# Altium project firesys.PrjPcb (part 2 of 2)

## Sheet ShiftRegister.SchDoc
size A3; SheetNumber: 6; SheetTotal: 11
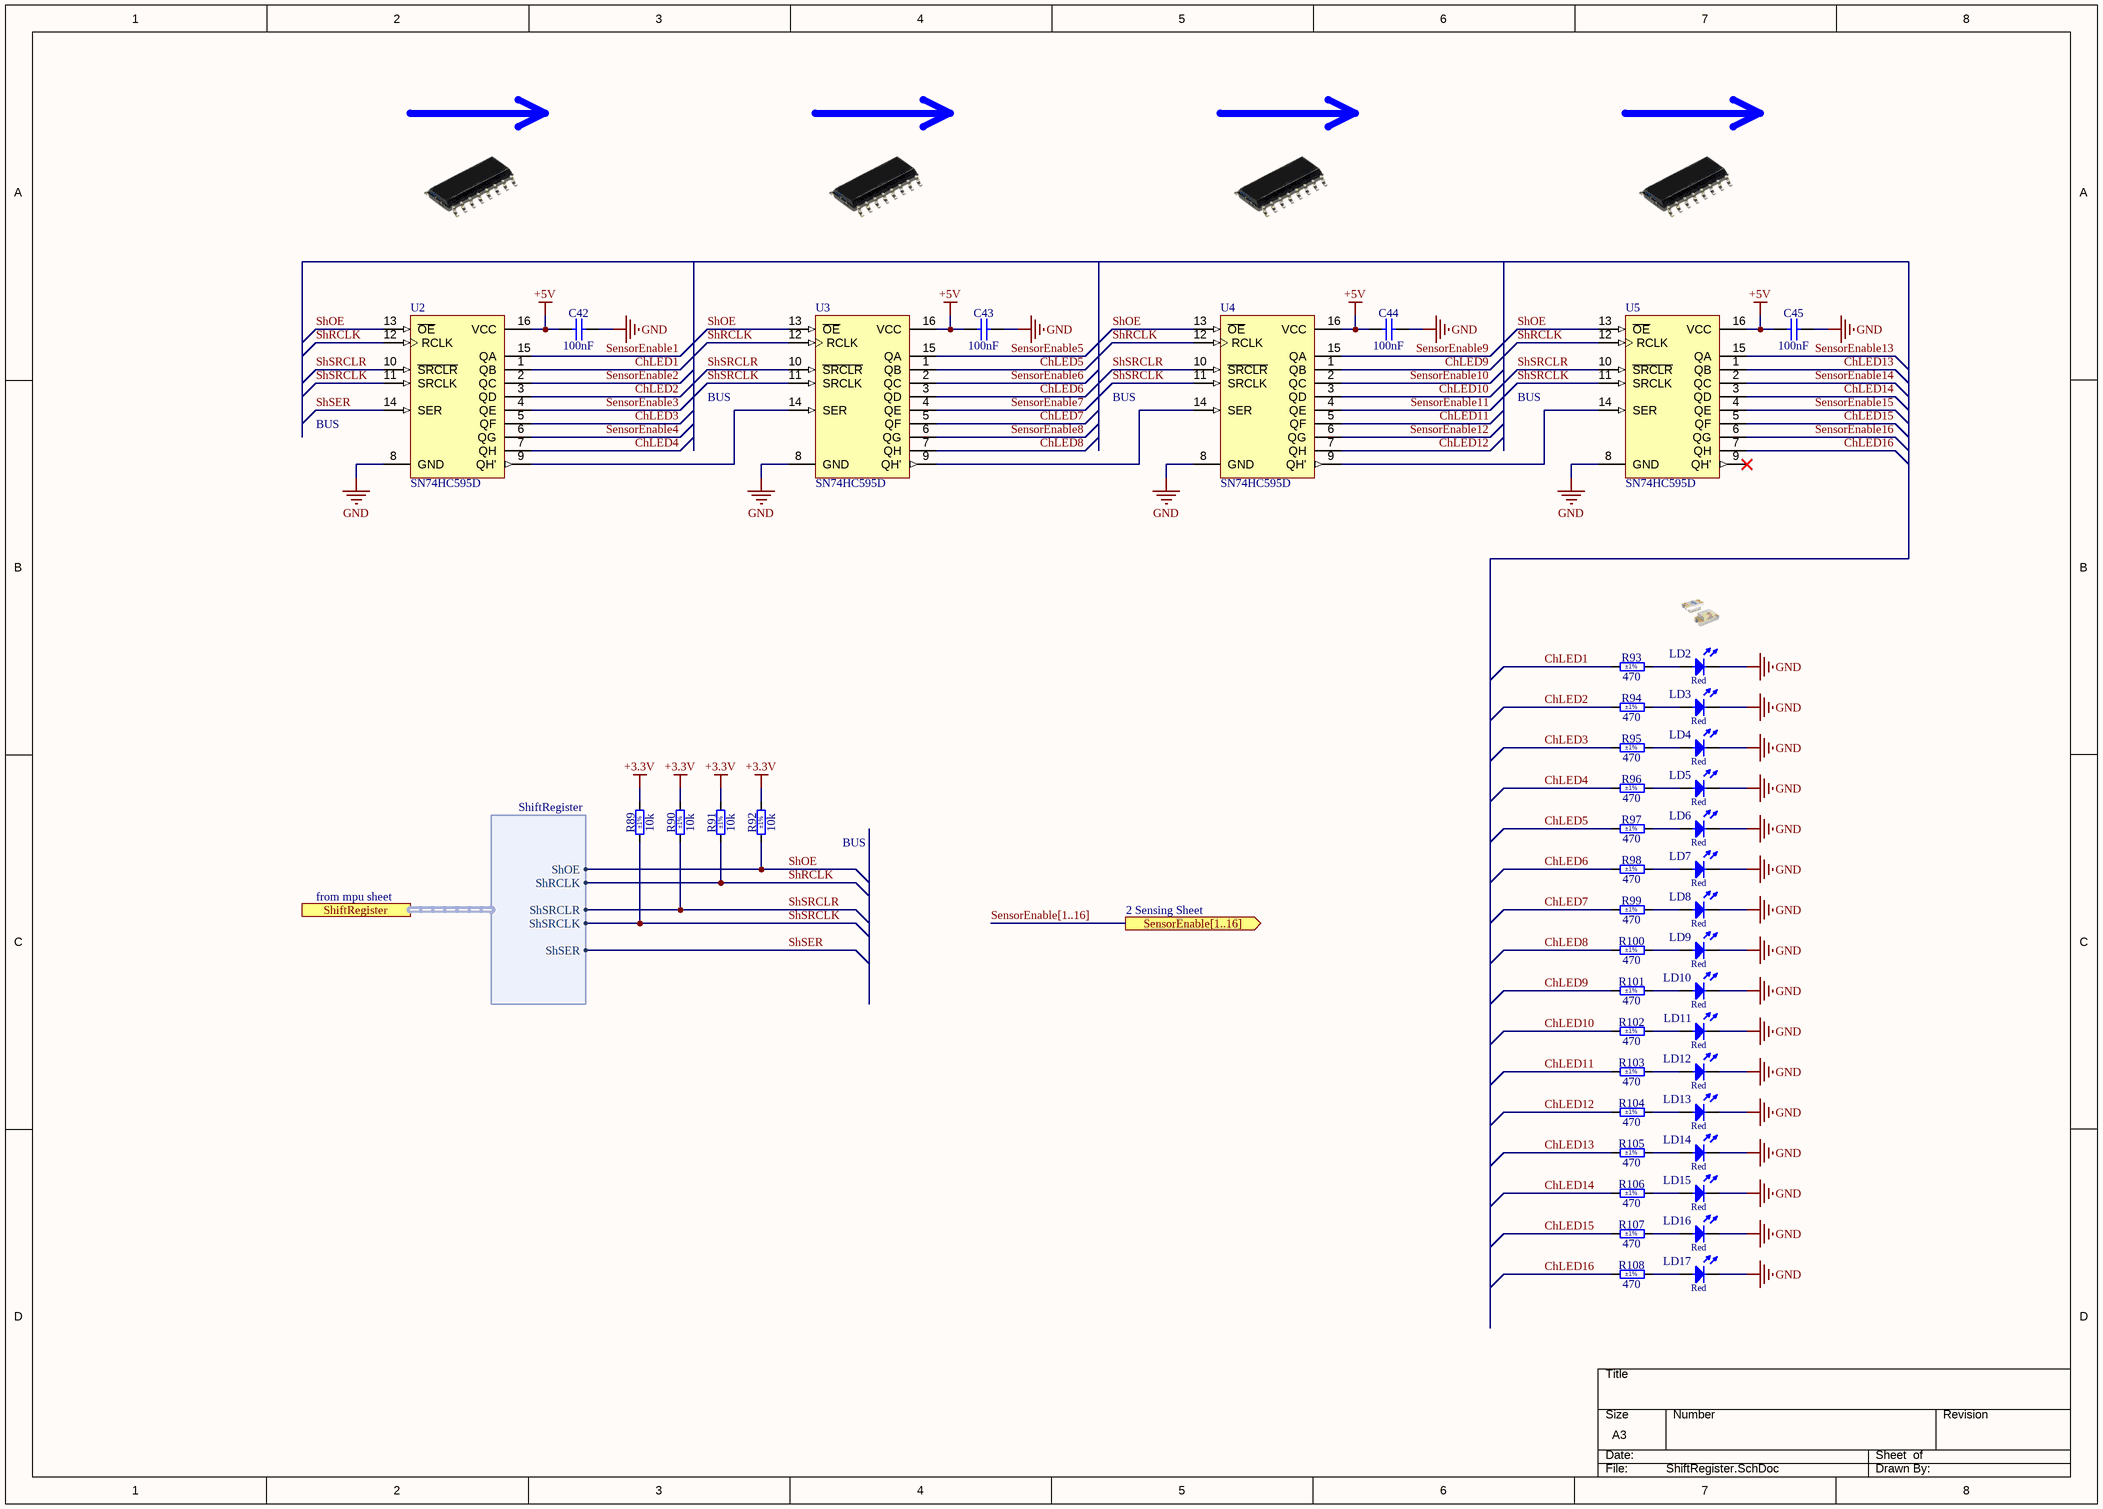
[diagram p4: ShiftRegister.SchDoc]

### Parts
C42  100nF  [CAPC1608X87N]
C43  100nF  [CAPC1608X87N]
C44  100nF  [CAPC1608X87N]
C45  100nF  [CAPC1608X87N]
LD2  Red  [LED_AVAGO_HSMH-C150]
LD3  Red  [LED_AVAGO_HSMH-C150]
LD4  Red  [LED_AVAGO_HSMH-C150]
LD5  Red  [LED_AVAGO_HSMH-C150]
LD6  Red  [LED_AVAGO_HSMH-C150]
LD7  Red  [LED_AVAGO_HSMH-C150]
LD8  Red  [LED_AVAGO_HSMH-C150]
LD9  Red  [LED_AVAGO_HSMH-C150]
LD10  Red  [LED_AVAGO_HSMH-C150]
LD11  Red  [LED_AVAGO_HSMH-C150]
LD12  Red  [LED_AVAGO_HSMH-C150]
LD13  Red  [LED_AVAGO_HSMH-C150]
LD14  Red  [LED_AVAGO_HSMH-C150]
LD15  Red  [LED_AVAGO_HSMH-C150]
LD16  Red  [LED_AVAGO_HSMH-C150]
LD17  Red  [LED_AVAGO_HSMH-C150]
R89  10k  Tolerance: ±1%  [RESC1608X55N]
R90  10k  Tolerance: ±1%  [RESC1608X55N]
R91  10k  Tolerance: ±1%  [RESC1608X55N]
R92  10k  Tolerance: ±1%  [RESC1608X55N]
R93  470  Tolerance: ±1%  [RESC1608X55N]
R94  470  Tolerance: ±1%  [RESC1608X55N]
R95  470  Tolerance: ±1%  [RESC1608X55N]
R96  470  Tolerance: ±1%  [RESC1608X55N]
R97  470  Tolerance: ±1%  [RESC1608X55N]
R98  470  Tolerance: ±1%  [RESC1608X55N]
R99  470  Tolerance: ±1%  [RESC1608X55N]
R100  470  Tolerance: ±1%  [RESC1608X55N]
R101  470  Tolerance: ±1%  [RESC1608X55N]
R102  470  Tolerance: ±1%  [RESC1608X55N]
R103  470  Tolerance: ±1%  [RESC1608X55N]
R104  470  Tolerance: ±1%  [RESC1608X55N]
R105  470  Tolerance: ±1%  [RESC1608X55N]
R106  470  Tolerance: ±1%  [RESC1608X55N]
R107  470  Tolerance: ±1%  [RESC1608X55N]
R108  470  Tolerance: ±1%  [RESC1608X55N]
U2  SN74HC595D  [SO16]
U3  SN74HC595D  [SO16]
U4  SN74HC595D  [SO16]
U5  SN74HC595D  [SO16]

### Ports
SensorEnable[1..16] (out), ShiftRegister (harness ShiftRegister)

### Harnesses
ShiftRegister: ShOE, ShRCLK, ShSRCLR, ShSRCLK, ShSER

### Nets
+3.3V: R89.2 R90.2 R91.2 R92.2
+5V: C42.1 C43.1 C44.1 C45.1 U2.16(VCC) U3.16(VCC) U4.16(VCC) U5.16(VCC)
GND: C42.2 C43.2 C44.2 C45.2 LD2.1(C) LD3.1(C) LD4.1(C) LD5.1(C) LD6.1(C) LD7.1(C) LD8.1(C) LD9.1(C) LD10.1(C) LD11.1(C) LD12.1(C) LD13.1(C) LD14.1(C) LD15.1(C) LD16.1(C) LD17.1(C) U2.8(GND) U3.8(GND) U4.8(GND) U5.8(GND)
ChLED1: R93.1 U2.1(QB)
ChLED2: R94.1 U2.3(QD)
ChLED3: R95.1 U2.5(QF)
ChLED4: R96.1 U2.7(QH)
ChLED5: R97.1 U3.1(QB)
ChLED6: R98.1 U3.3(QD)
ChLED7: R99.1 U3.5(QF)
ChLED8: R100.1 U3.7(QH)
ChLED9: R101.1 U4.1(QB)
ChLED10: R102.1 U4.3(QD)
ChLED11: R103.1 U4.5(QF)
ChLED12: R104.1 U4.7(QH)
ChLED13: R105.1 U5.1(QB)
ChLED14: R106.1 U5.3(QD)
ChLED15: R107.1 U5.5(QF)
ChLED16: R108.1 U5.7(QH)
SensorEnable1: U2.15(QA)
SensorEnable2: U2.2(QC)
SensorEnable3: U2.4(QE)
SensorEnable4: U2.6(QG)
SensorEnable5: U3.15(QA)
SensorEnable6: U3.2(QC)
SensorEnable7: U3.4(QE)
SensorEnable8: U3.6(QG)
SensorEnable9: U4.15(QA)
SensorEnable10: U4.2(QC)
SensorEnable11: U4.4(QE)
SensorEnable12: U4.6(QG)
SensorEnable13: U5.15(QA)
SensorEnable14: U5.2(QC)
SensorEnable15: U5.4(QE)
SensorEnable16: U5.6(QG)
ShOE: R92.1 U2.13(~{OE}) U3.13(~{OE}) U4.13(~{OE}) U5.13(~{OE}) ; port ShiftRegister.ShOE
ShRCLK: R91.1 U2.12(RCLK) U3.12(RCLK) U4.12(RCLK) U5.12(RCLK) ; port ShiftRegister.ShRCLK
ShSER: U2.14(SER) ; port ShiftRegister.ShSER
ShSRCLK: R89.1 U2.11(SRCLK) U3.11(SRCLK) U4.11(SRCLK) U5.11(SRCLK) ; port ShiftRegister.ShSRCLK
ShSRCLR: R90.1 U2.10(~{SRCLR}) U3.10(~{SRCLR}) U4.10(~{SRCLR}) U5.10(~{SRCLR}) ; port ShiftRegister.ShSRCLR
NetLD2_2: LD2.2(A) R93.2
NetLD3_2: LD3.2(A) R94.2
NetLD4_2: LD4.2(A) R95.2
NetLD5_2: LD5.2(A) R96.2
NetLD6_2: LD6.2(A) R97.2
NetLD7_2: LD7.2(A) R98.2
NetLD8_2: LD8.2(A) R99.2
NetLD9_2: LD9.2(A) R100.2
NetLD10_2: LD10.2(A) R101.2
NetLD11_2: LD11.2(A) R102.2
NetLD12_2: LD12.2(A) R103.2
NetLD13_2: LD13.2(A) R104.2
NetLD14_2: LD14.2(A) R105.2
NetLD15_2: LD15.2(A) R106.2
NetLD16_2: LD16.2(A) R107.2
NetLD17_2: LD17.2(A) R108.2
NetU2_9: U2.9(QH') U3.14(SER)
NetU3_9: U3.9(QH') U4.14(SER)
NetU4_9: U4.9(QH') U5.14(SER)

Not connected (* = marked no-connect by the designer): U5 9(QH')*

### Buses and harness runs
bus SensorEnable[1..16] = port SensorEnable[1..16]

### Notes on the sheet
- BUS
- from mpu sheet
- 2 Sensing Sheet
- THIS DOCUMENT AND THE DATA DISCLOSED HEREIN OR
- HEREWITH IS THE PROPERTY OF ALTIUM LIMITED AND MAY
- DWG NO:
- REVISION
- REV:
- DESCRIPTION
- DATE
- APPROVED
- BE FREELY DISTRIBUTED IN WHOLE. NO RIGHTS ARE
- RESERVED OR EXPRESS OR IMPLIED WARANTEE GIVEN.
- ENG:
- APPROVALS
- PROJECT
- DSN:
- CHK:
- REFERENCE DOCUMENTS
- PROJECT REVISION:
- TITLE
- DOCUMENT REVISION:
- DESIGN ITEM:
- BOM:
- FAB DWG:
- PCB DWG:
- ASSY DWG:
- SCALE:
- A3
- SIZE
- CAGE CODE
- FILE NAME
- DWG NO.
- SHEET
- OF
- REV

### Library data of the parts
C42-C45 = CC0603_100NF_50V_10%_X7R: Non-polarised capacitor; Part Description: SMD Multilayer Chip Ceramic Capacitor; Manufacturer: GENERIC; Manufacturer1 Part Number: 223858615649; Voltage: 50V; TC: X7R; Tolerance: ±10%; Part Number: CC0603_100NF_50V_10%_X7R; Component Kind: Standard; Component Type: Standard; Pin Count: 2; Value: 100nF; Status: Preferred; Manufacturer Part Number: CC0603_100NF_50V_10%_X7R; Case: 0603; Mounted: Yes; Socket: No; SMD: Yes; Sense: No; Manufacturer1 Example: PHYCOMP; Manufacturer1 ComponentHeight: 0.87mm; HelpURL: \\cern.ch\dfs\Applications\Altium\Datasheets\CC0603_X7R_PHYCOMP.pdf; Author: CERN DEM JLC; CreateDate: 03.12.2007; LatestRevisionDate: 03.12.2007
LD2-LD17 = LED_AVAGO_HSMH-C150: LED Red 1C 2A; Part Description: Red Diffused Surface Mount LED (1206 Case); Manufacturer: AVAGO TECHNOLOGIES; PressFit: No; Bonding: No; Part Number: LED_AVAGO_HSMH-C150; Component Kind: Standard; Component Type: Standard; Color: Red; PackageDescription: Red Diffused Chip LED, 2-Leads, Body 3.2 x1.6mm, IPC Medium Density; Manufacturer Part Number: HSMH-C150; Pin Count: 2; Case: 1206; Mounted: Yes; Socket: No; SMD: Yes; Sense: No; ComponentHeight: 1.2mm; HelpURL: \\cern.ch\dfs\Applications\Altium\Datasheets\LED_AVAGO_HSMH-C150.pdf; Author: CERN DEM JLC; CreateDate: 08.03.2018; LatestRevisionDate: 08.03.2018
R89-R92 = R0603_10K_1%_0.1W_100PPM: Resistor - 1%; Part Description: General Purpose Thick Film Chip Resistor; Manufacturer: GENERIC; Manufacturer1 Part Number: NRC06F1002TRF; Power: 0.1W; TC: ±100ppm/°C; PressFit: No; Part Number: R0603_10K_1%_0.1W_100PPM; Component Kind: Standard; Component Type: Standard; Pin Count: 2; Value: 10k; Status: Preferred; Manufacturer Part Number: R0603_10K_1%_0.1W_100PPM; Case: 0603; Mounted: Yes; Sense: No; Socket: No; SMD: Yes; Manufacturer1 Example: NIC COMPONENT; Manufacturer1 ComponentHeight: 0.55mm; HelpURL: \\cern.ch\dfs\Applications\Altium\Datasheets\R0603_NIC_NRC.pdf; Author: CERN DEM JLC; CreateDate: 03.12.2007; LatestRevisionDate: 13.03.2008
R93-R108 = R0603_470R_1%_0.1W_100PPM: Resistor - 1%; Part Description: General Purpose Thick Film Chip Resistor; Manufacturer: GENERIC; Manufacturer1 Part Number: NRC06F4700TRF; Power: 0.1W; TC: ±100ppm/°C; PressFit: No; Part Number: R0603_470R_1%_0.1W_100PPM; Component Kind: Standard; Component Type: Standard; Pin Count: 2; Value: 470; Status: Preferred; Manufacturer Part Number: R0603_470R_1%_0.1W_100PPM; Case: 0603; Mounted: Yes; Sense: No; Socket: No; SMD: Yes; Manufacturer1 Example: NIC COMPONENT; Manufacturer1 ComponentHeight: 0.55mm; HelpURL: \\cern.ch\dfs\Applications\Altium\Datasheets\R0603_NIC_NRC.pdf; Author: CERN DEM JLC; CreateDate: 03.12.2007; LatestRevisionDate: 13.03.2008
U2-U5 = SN74HC595D: 8-Bit Shift Register with 3-State Output Registers; Published: 8-Jun-2000; LatestRevisionDate: 13-Apr-2006; LatestRevisionNote: IPC-7351 Footprint Added.; DatasheetVersion: May-1997; PackageVersion: Jan-1998; PackageReference: D016; Publisher: Altium Limited; PackageDescription: 16-Pin Small Outline Integrated Circuit 1.27 mm Pitch; Code_IPC: SOIC127P600-16; ComponentLink1Description: Manufacturer Link; ComponentLink1URL: http://www.ti.com/; ComponentLink2Description: Datasheet; ComponentLink2URL: http://www-s.ti.com/sc/ds/sn74hc595.pdf

## Sheet Sound.SchDoc
size A4; SheetNumber: 7; SheetTotal: 11
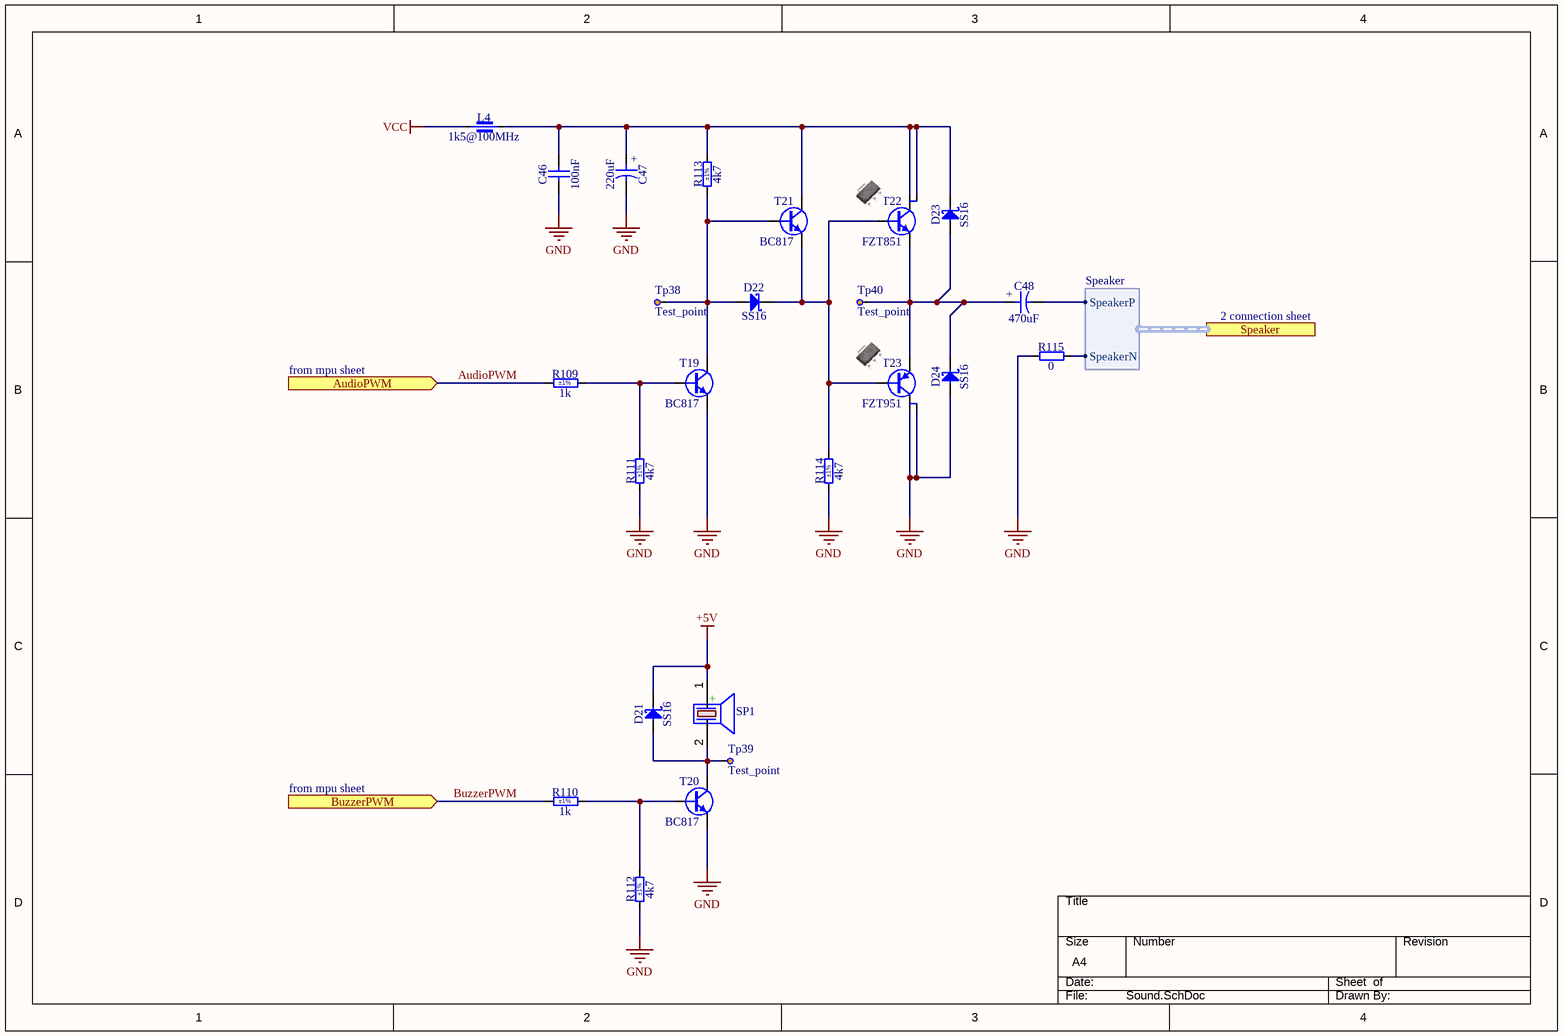
[diagram p5: Sound.SchDoc]

### Parts
C46  100nF  [CAPC3216X140N]
C47  220uF  [CAPAE830X1020N]
C48  470uF  [CAPPR500-1050X1750]
D21  SS16  [DIOM5127X229N]
D22  SS16  [DIOM5127X229N]
D23  SS16  [DIOM5127X229N]
D24  SS16  [DIOM5127X229N]
L4  1k5@100MHz  [INDC2012X110N]
R109  1k  Tolerance: ±1%  [RESC1608X55N]
R110  1k  Tolerance: ±1%  [RESC1608X55N]
R111  4k7  Tolerance: ±1%  [RESC1608X55N]
R112  4k7  Tolerance: ±1%  [RESC1608X55N]
R113  4k7  Tolerance: ±1%  [RESC3216X65N]
R114  4k7  Tolerance: ±1%  [RESC3216X65N]
R115  0  [RESC1608X55N]
SP1  (no value)  [BUZZER 7.62mm DC]
T19  BC817  [SOT95P230X110-3N]
T20  BC817  [SOT95P230X110-3N]
T21  BC817  [SOT95P230X110-3N]
T22  FZT851  [SOT230P700X180-4N]
T23  FZT951  [SOT230P700X180-4N]
Tp38  Test_point  [TP_C40]
Tp39  Test_point  [TP_C40]
Tp40  Test_point  [TP_C40]

### Ports
AudioPWM (in), BuzzerPWM (in), Speaker (harness Speaker)

### Harnesses
Speaker: SpeakerP, SpeakerN

### Nets
+5V: D21.1(C) SP1.1(+)
GND: C46.1 C47.2 D24.2(A) R111.1 R112.1 R114.1 R115.1 T19.2(E) T20.2(E) T23.2(C) T23.4(C)
VCC: L4.1
AudioPWM: R109.1 ; port AudioPWM
BuzzerPWM: R110.1 ; port BuzzerPWM
NetC46_2: C46.2 C47.1 D23.1(C) L4.2 R113.2 T21.3(C) T22.2(C) T22.4(C)
NetC48_1: C48.1 D23.2(A) D24.1(C) T22.3(E) T23.3(E) Tp40.1
NetC48_2: C48.2 ; port Speaker.SpeakerP
NetD21_2: D21.2(A) SP1.2(-) T20.3(C) Tp39.1
NetD22_1: D22.1(C) R114.2 T21.2(E) T22.1(B) T23.1(B)
NetD22_2: D22.2(A) R113.1 T19.3(C) T21.1(B) Tp38.1
NetR109_2: R109.2 R111.2 T19.1(B)
NetR110_2: R110.2 R112.2 T20.1(B)
NetR115_2: R115.2 ; port Speaker.SpeakerN

### Notes on the sheet
- 2 connection sheet
- from mpu sheet
- THIS DOCUMENT AND THE DATA DISCLOSED HEREIN OR
- HEREWITH IS THE PROPERTY OF ALTIUM LIMITED AND MAY
- DWG NO:
- REVISION
- REV:
- DESCRIPTION
- DATE
- APPROVED
- BE FREELY DISTRIBUTED IN WHOLE. NO RIGHTS ARE
- RESERVED OR EXPRESS OR IMPLIED WARANTEE GIVEN.
- ENG:
- APPROVALS
- PROJECT
- DSN:
- CHK:
- REFERENCE DOCUMENTS
- PROJECT REVISION:
- TITLE
- DOCUMENT REVISION:
- DESIGN ITEM:
- BOM:
- FAB DWG:
- PCB DWG:
- ASSY DWG:
- SCALE:
- A3
- SIZE
- CAGE CODE
- FILE NAME
- DWG NO.
- SHEET
- OF
- REV
- (in symbol CAE830-1020_220UF_50V_20%) +
- (in symbol CAER_470UF_35V_20%_VISHAY_MAL203850471E3) +

### Library data of the parts
C46 = CC1206_100NF_100V_10%_X7R: Non-polarised capacitor; Part Description: SMD Multilayer Chip Ceramic Capacitor; Manufacturer: GENERIC; Manufacturer1 Part Number: 222260115649; Voltage: 100V; TC: X7R; Tolerance: ±10%; Part Number: CC1206_100NF_100V_10%_X7R; Component Kind: Standard; Component Type: Standard; Pin Count: 2; Value: 100nF; Status: Preferred; Manufacturer Part Number: CC1206_100NF_100V_10%_X7R; Case: 1206; Mounted: Yes; Socket: No; SMD: Yes; Sense: No; Manufacturer1 Example: PHYCOMP; Manufacturer1 ComponentHeight: 1.25mm; HelpURL: \\cern.ch\dfs\Applications\Altium\Datasheets\CC1206_X7R_PHYCOMP.pdf; Author: CERN DEM JLC; CreateDate: 24.08.2009; LatestRevisionDate: 24.08.2009
C47 = CAE830-1020_220UF_50V_20%: Polarised capacitor; Part Description: Aluminum Electrolytic SMT Capacitor; Manufacturer: PANASONIC; Manufacturer Part Number: EEEFT1H221AP; Voltage: 50V; Tolerance: ±20%; Part Number: CAE830-1020_220UF_50V_20%; Component Kind: Standard; Component Type: Standard; Pin Count: 2; Value: 220uF; Status: Not Recommended; Case: F; Mounted: Yes; Socket: No; SMD: Yes; Sense: No; ComponentHeight: 10.2mm; HelpURL: \\cern.ch\dfs\Applications\Altium\Datasheets\CAE_PANASONIC_FT.pdf; Author: CERN DEM BC; CreateDate: 12.04.2021; LatestRevisionDate: 12.04.2021
C48 = CAER_470UF_35V_20%_VISHAY_MAL203850471E3: Polarised capacitor; Part Description: Radial Standard Ultra Miniature Aluminum Electrolytic Capacitor (038 RSU Series); Manufacturer: VISHAY BCCOMPONENTS; Voltage: 35V; Tolerance: ±20%; Part Number: CAER_470UF_35V_20%_VISHAY_MAL203850471E3; Component Kind: Standard; Component Type: Standard; Pin Count: 2; Value: 470uF; Status: None; Manufacturer Part Number: MAL203850471E3; Case: LS5 D10.5 x H17.5; Mounted: Yes; Socket: No; SMD: No; Sense: No; ComponentHeight: 13.5mm; HelpURL: \\cern.ch\dfs\Applications\Altium\Datasheets\CAER_VISHAY_038 RSU.pdf; Author: CERN DEM JLC; CreateDate: 11.04.2012; LatestRevisionDate: 11.04.2012
D21-D24 = SS16: Schottky Diode; Part Description: Surface Mount Schottky Barrier Rectifier; Manufacturer: VISHAY GENERAL SEMICONDUCTOR; Voltage: 60V; Power: 1A; PressFit: No; Bonding: No; Part Number: SS16; Component Kind: Standard; Component Type: Standard; Device: SS16; PackageDescription: DO-214-AC/SMA Diode, Molded Body; 5.10mm L X 2.67mm W X 2.29mm H, IPC Medium Density; Manufacturer Part Number: SS16; Pin Count: 2; Case: DO-214AC; Mounted: Yes; Socket: No; SMD: Yes; Sense: No; ComponentHeight: 2.29mm; HelpURL: \\cern.ch\dfs\Applications\Altium\Datasheets\SS16.pdf; Author: CERN DEM JLC; CreateDate: 15.07.2008; LatestRevisionDate: 23.08.2010
L4 = IND0805_WURTH_742792097: Part Description: SMD EMI Suppression Chip Ferrite Bead (WE-CBF Series); Manufacturer: WURTH ELEKTRONIK; Power: 1A; Resistance: 0.3R; Tolerance: ±25%; Part Number: IND0805_WURTH_742792097; Component Kind: Standard; Component Type: Standard; Pin Count: 2; Value: 1k5@100MHz; Manufacturer Part Number: 742792097; Case: 0805; Mounted: Yes; Socket: No; SMD: Yes; Sense: No; ComponentHeight: 1.1mm; HelpURL: \\cern.ch\dfs\Applications\Altium\Datasheets\IND0805_WURTH_742792097.pdf; Author: CERN DEM MR; CreateDate: 29.06.2017; LatestRevisionDate: 25.10.2018
R109 R110 = R0603_1K_1%_0.1W_100PPM: Resistor - 1%; Part Description: General Purpose Thick Film Chip Resistor; Manufacturer: GENERIC; Manufacturer1 Part Number: NRC06F1001TRF; Power: 0.1W; TC: ±100ppm/°C; PressFit: No; Part Number: R0603_1K_1%_0.1W_100PPM; Component Kind: Standard; Component Type: Standard; Pin Count: 2; Value: 1k; Status: Preferred; Manufacturer Part Number: R0603_1K_1%_0.1W_100PPM; Case: 0603; Mounted: Yes; Sense: No; Socket: No; SMD: Yes; Manufacturer1 Example: NIC COMPONENT; Manufacturer1 ComponentHeight: 0.55mm; HelpURL: \\cern.ch\dfs\Applications\Altium\Datasheets\R0603_NIC_NRC.pdf; Author: CERN DEM JLC; CreateDate: 03.12.2007; LatestRevisionDate: 13.03.2008
R111 R112 = R0603_4K7_1%_0.1W_100PPM: Resistor - 1%; Part Description: General Purpose Thick Film Chip Resistor; Manufacturer: GENERIC; Manufacturer1 Part Number: NRC06F4701TRF; Power: 0.1W; TC: ±100ppm/°C; PressFit: No; Part Number: R0603_4K7_1%_0.1W_100PPM; Component Kind: Standard; Component Type: Standard; Pin Count: 2; Value: 4k7; Status: Preferred; Manufacturer Part Number: R0603_4K7_1%_0.1W_100PPM; Case: 0603; Mounted: Yes; Sense: No; Socket: No; SMD: Yes; Manufacturer1 Example: NIC COMPONENT; Manufacturer1 ComponentHeight: 0.55mm; HelpURL: \\cern.ch\dfs\Applications\Altium\Datasheets\R0603_NIC_NRC.pdf; Author: CERN DEM JLC; CreateDate: 03.12.2007; LatestRevisionDate: 13.03.2008
R113 R114 = R1206_4K7_1%_0.25W_100PPM: Resistor - 1%; Part Description: General Purpose Thick Film Chip Resistor; Manufacturer: GENERIC; Manufacturer1 Part Number: NRC12F4701TRF; Power: 0.25W; TC: ±100ppm/°C; PressFit: No; Part Number: R1206_4K7_1%_0.25W_100PPM; Component Kind: Standard; Component Type: Standard; Pin Count: 2; Value: 4k7; Status: Preferred; Manufacturer Part Number: R1206_4K7_1%_0.25W_100PPM; Case: 1206; Mounted: Yes; Sense: No; Socket: No; SMD: Yes; Manufacturer1 Example: NIC COMPONENT; Manufacturer1 ComponentHeight: 0.65mm; HelpURL: \\cern.ch\dfs\Applications\Altium\Datasheets\R1206_NIC_NRC.pdf; Author: CERN DEM JLC; CreateDate: 03.12.2007; LatestRevisionDate: 13.03.2008
R115 = R0603_0R_JUMPER: Resistor; Part Description: 1A (0.05R Max DC Resistance) Zero Ohm Jumper; Manufacturer: GENERIC; Manufacturer1 Part Number: NRC06Z0; PressFit: No; Part Number: R0603_0R_JUMPER; Component Kind: Standard; Component Type: Standard; Pin Count: 2; Value: 0; Status: Preferred; Manufacturer Part Number: R0603_0R_JUMPER; Case: 0603; Mounted: Yes; Sense: No; Socket: No; SMD: Yes; Manufacturer1 Example: NIC COMPONENT; Manufacturer1 ComponentHeight: 0.55mm; HelpURL: \\cern.ch\dfs\Applications\Altium\Datasheets\R0603_NIC_NRC.pdf; Author: CERN DEM JLC; CreateDate: 03.12.2007; LatestRevisionDate: 13.03.2008
SP1 = PIEZO BUZZER: PIEZO BUZZER ACTIVE; Designer: Abbas Basereh; Comment_1: SPEAKER AND BEEP; Design Date: 1395/11/14; ComponentLink2Description: Reference; PackageDescription: THD; Publisher: Abbas Basereh; Mounting Technology: THD; Pin Count: 2; Status: Unreleased
T19-T21 = BC817: NPN Transistor; Part Description: 45V 500mA NPN General-Purpose Transistor; Manufacturer: NXP SEMICONDUCTORS; PressFit: No; Bonding: No; Part Number: BC817; Component Kind: Standard; Component Type: Standard; Device: BC817; PackageDescription: SOT23, 0.95mm Pitch; 3 Pin, 1.30mm W X 2.90mm L X 1.10mm H body, IPC Medium Density; Manufacturer Part Number: BC817; Pin Count: 3; Case: SOT23-3; Mounted: Yes; Socket: No; SMD: Yes; Sense: No; ComponentHeight: 1.1mm; HelpURL: \\cern.ch\dfs\Applications\Altium\Datasheets\BC817.pdf; Author: CERN DEM JLC; CreateDate: 12.05.2011; LatestRevisionDate: 12.05.2011
T22 = FZT851: NPN Transistor; Part Description: 60V 6A NPN Silicon Planar High Current Transistor; Manufacturer: ZETEX SEMICONDUCTORS; PressFit: No; Bonding: No; Part Number: FZT851; Component Kind: Standard; Component Type: Standard; Device: FZT851; PackageDescription: SOT223, 2.30mm Pitch; 4 Pin, 3.70mm W X 6.70mm L X 1.80mm H body, IPC Medium Density; Manufacturer Part Number: FZT851; Pin Count: 4; Case: SOT223; Mounted: Yes; Socket: No; SMD: Yes; Sense: No; ComponentHeight: 1.8mm; HelpURL: \\cern.ch\dfs\Applications\Altium\Datasheets\FZT851.pdf; Author: CERN DEM JLC; CreateDate: 16.07.2008; LatestRevisionDate: 16.07.2008
T23 = FZT951: PNP Transistor; Part Description: 60V 5A PNP Silicon Planar High Current Transistor; Manufacturer: ZETEX SEMICONDUCTORS; PressFit: No; Bonding: No; Part Number: FZT951; Component Kind: Standard; Component Type: Standard; Device: FZT951; PackageDescription: SOT223, 2.30mm Pitch; 4 Pin, 3.70mm W X 6.70mm L X 1.80mm H body, IPC Medium Density; Manufacturer Part Number: FZT951; Pin Count: 4; Case: SOT223; Mounted: Yes; Socket: No; SMD: Yes; Sense: No; ComponentHeight: 1.8mm; HelpURL: \\cern.ch\dfs\Applications\Altium\Datasheets\FZT951.pdf; Author: CERN DEM JLC; CreateDate: 16.07.2008; LatestRevisionDate: 16.07.2008
Tp38-Tp40 = Test point: Published: 8-Jun-2000; LatestRevisionDate: 17-Jul-2002; LatestRevisionNote: Re-released for DXP Platform.; PackageReference: AXIAL-0.3; Publisher: Altium Limited

## Sheet Interface.SchDoc
size A4; SheetNumber: 8; SheetTotal: 11
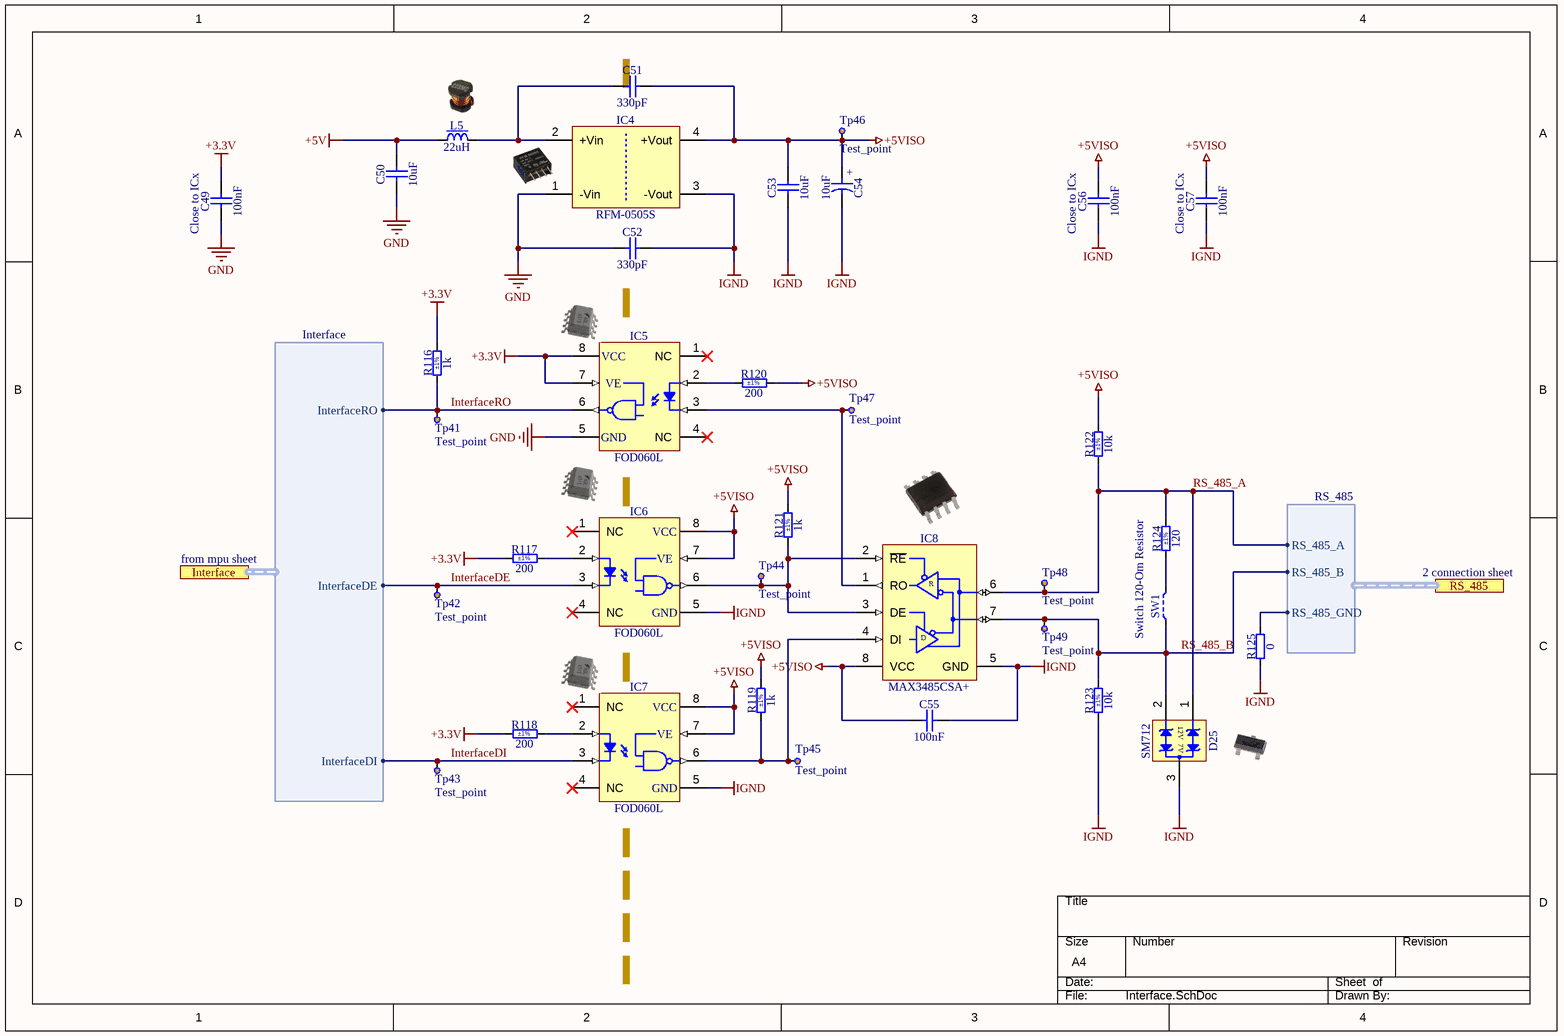
[diagram p6: Interface.SchDoc]

### Parts
C49  100nF  [CAPC1608X87N]
C50  10uF  [CAPC3216X140N]
C51  330pF  [CAPC4620X220N]
C52  330pF  [CAPC4620X220N]
C53  10uF  [CAPC3216X140N]
C54  10uF  [CAPAE430X540N]
C55  100nF  [CAPC1608X87N]
C56  100nF  [CAPC1608X87N]
C57  100nF  [CAPC1608X87N]
D25  SM712  [SOT95P237X112-3N]
IC4  RFM-0505S  [DCDC_RECOM_RFM]
IC5  FOD060L  [SOIC127P594X363-8N]
IC6  FOD060L  [SOIC127P594X363-8N]
IC7  FOD060L  [SOIC127P594X363-8N]
IC8  MAX3485CSA+  [SOIC127P600X175-8N]
L5  22uH  [IND_MURATA-PS_8200]
R116  1k  Tolerance: ±1%  [RESC1608X55N]
R117  200  Tolerance: ±1%  [RESC1608X55N]
R118  200  Tolerance: ±1%  [RESC1608X55N]
R119  1k  Tolerance: ±1%  [RESC1608X55N]
R120  200  Tolerance: ±1%  [RESC1608X55N]
R121  1k  Tolerance: ±1%  [RESC1608X55N]
R122  10k  Tolerance: ±1%  [RESC1608X55N]
R123  10k  Tolerance: ±1%  [RESC1608X55N]
R124  120  Tolerance: ±1%  [RESC3216X65N]
R125  0  [RESC1608X55N]
SW1  Switch  [JUMPSMD0805_G50]  (value not drawn)  (no BOM)
Tp41  Test_point  [TP_C40]
Tp42  Test_point  [TP_C40]
Tp43  Test_point  [TP_C40]
Tp44  Test_point  [TP_C40]
Tp45  Test_point  [TP_C40]
Tp46  Test_point  [TP_C40]
Tp47  Test_point  [TP_C40]
Tp48  Test_point  [TP_C40]
Tp49  Test_point  [TP_C40]

### Ports
Interface (harness Interface), RS_485 (harness RS_485)

### Harnesses
RS_485: RS_485_A, RS_485_B, RS_485_GND
Interface: InterfaceRO, InterfaceDE, InterfaceDI

### Nets
+3.3V: C49.2 IC5.7(VE) IC5.8(VCC) R116.2 R117.1 R118.1
+5V: C50.2 L5.1
+5VISO: C51.2 C53.2 C54.1 C55.1 C56.2 C57.2 IC4.4(+Vout) IC6.7(VE) IC6.8(VCC) IC7.7(VE) IC7.8(VCC) IC8.8(VCC) R119.2 R120.2 R121.2 R122.2 Tp46.1
GND: C49.1 C50.1 C52.1 IC4.1(-Vin) IC5.5(GND)
IGND: C52.2 C53.1 C54.2 C55.2 C56.1 C57.1 D25.3(GND) IC4.3(-Vout) IC6.5(GND) IC7.5(GND) IC8.5(GND) R123.1 R125.1
InterfaceDE: IC6.3(K) Tp42.1 ; port Interface.InterfaceDE
InterfaceDI: IC7.3(K) Tp43.1 ; port Interface.InterfaceDI
InterfaceRO: IC5.6(VO) R116.1 Tp41.1 ; port Interface.InterfaceRO
RS_485_A: D25.1(I/O1) IC8.6(A) R122.1 R124.2 Tp48.1 ; port RS_485.RS_485_A
RS_485_B: D25.2(I/O2) IC8.7(B) R123.2 SW1.1 Tp49.1 ; port RS_485.RS_485_B
NetC51_1: C51.1 IC4.2(+Vin) L5.2
NetIC5_2: IC5.2(A) R120.1
NetIC5_3: IC5.3(K) IC8.1(RO) Tp47.1
NetIC6_2: IC6.2(A) R117.2
NetIC6_6: IC6.6(VO) IC8.2(~{RE}) IC8.3(DE) R121.1 Tp44.1
NetIC7_2: IC7.2(A) R118.2
NetIC7_6: IC7.6(VO) IC8.4(DI) R119.1 Tp45.1
NetR124_1: R124.1 SW1.2
NetR125_2: R125.2 ; port RS_485.RS_485_GND

Not connected (* = marked no-connect by the designer): IC5 1(NC)* 4(NC)*; IC6 1(NC)* 4(NC)*; IC7 1(NC)* 4(NC)*

### Notes on the sheet
- (near C49) Close to ICx
- (near C56) Close to ICx
- (near C57) Close to ICx
- from mpu sheet
- 2 connection sheet
- Switch 120-Om Resistor
- THIS DOCUMENT AND THE DATA DISCLOSED HEREIN OR
- HEREWITH IS THE PROPERTY OF ALTIUM LIMITED AND MAY
- DWG NO:
- REVISION
- REV:
- DESCRIPTION
- DATE
- APPROVED
- BE FREELY DISTRIBUTED IN WHOLE. NO RIGHTS ARE
- RESERVED OR EXPRESS OR IMPLIED WARANTEE GIVEN.
- ENG:
- APPROVALS
- PROJECT
- DSN:
- CHK:
- REFERENCE DOCUMENTS
- PROJECT REVISION:
- TITLE
- DOCUMENT REVISION:
- DESIGN ITEM:
- BOM:
- FAB DWG:
- PCB DWG:
- ASSY DWG:
- SCALE:
- A3
- SIZE
- CAGE CODE
- FILE NAME
- DWG NO.
- SHEET
- OF
- REV
- (in symbol CAE430-540_10UF_16V_20%) +
- (in symbol MAX3485CSA+) R; D
- (in symbol SM712) 12V; 7V

### Library data of the parts
C49 C55-C57 = CC0603_100NF_50V_10%_X7R: as C42 on sheet ShiftRegister; Part Number: CC0603_100NF_50V_10%_X7R; Component Kind: Standard; Component Type: Standard; Pin Count: 2; Value: 100nF; Status: Preferred; Manufacturer Part Number: CC0603_100NF_50V_10%_X7R; Case: 0603; Mounted: Yes; Socket: No; SMD: Yes; Sense: No; Manufacturer1 Example: PHYCOMP; Manufacturer1 ComponentHeight: 0.87mm; HelpURL: \\cern.ch\dfs\Applications\Altium\Datasheets\CC0603_X7R_PHYCOMP.pdf; Author: CERN DEM JLC; CreateDate: 03.12.2007; LatestRevisionDate: 03.12.2007
C50 C53 = CC1206_10UF_16V_10%_X7R: Non-polarised capacitor; Part Description: SMD Multilayer Chip Ceramic Capacitor; Manufacturer: GENERIC; Manufacturer1 Part Number: C1206C106K4RAC; Voltage: 16V; TC: X7R; Tolerance: ±10%; Part Number: CC1206_10UF_16V_10%_X7R; Component Kind: Standard; Component Type: Standard; Pin Count: 2; Value: 10uF; Status: Preferred; Manufacturer Part Number: CC1206_10UF_16V_10%_X7R; Case: 1206; Mounted: Yes; Socket: No; SMD: Yes; Sense: No; Manufacturer1 Example: KEMET; Manufacturer1 ComponentHeight: 1.8mm; HelpURL: \\cern.ch\dfs\Applications\Altium\Datasheets\CC1206_X7R_KEMET.pdf; Author: CERN DEM JLC; CreateDate: 28.04.2009; LatestRevisionDate: 28.04.2009
C51 C52 = CC1808_330PF_3KV_10%_X7R: Non-polarised capacitor; Part Description: High Voltage MLC Chip Capacitor; Manufacturer: GENERIC; Manufacturer1 Part Number: 1808HC331KAT1A; Voltage: 3kV; TC: X7R; Tolerance: ±10%; Part Number: CC1808_330PF_3KV_10%_X7R; Component Kind: Standard; Component Type: Standard; Pin Count: 2; Value: 330pF; Status: None; Manufacturer Part Number: CC1808_330PF_3KV_10%_X7R; Case: 1808; Mounted: Yes; Socket: No; SMD: Yes; Sense: No; Manufacturer1 Example: AVX; Manufacturer1 ComponentHeight: 2.20mm; HelpURL: \\cern.ch\dfs\Applications\Altium\Datasheets\CC1808_X7R_AVX_HV-MLC.pdf; Author: CERN DEM MR; CreateDate: 16.11.2017; LatestRevisionDate: 16.11.2017
C54 = CAE430-540_10UF_16V_20%: Polarised capacitor; Part Description: Aluminum Electrolytic SMT Capacitor; Manufacturer: PANASONIC; Manufacturer Part Number: EEEFK1C100AR; Voltage: 16V; Tolerance: ±20%; Part Number: CAE430-540_10UF_16V_20%; Component Kind: Standard; Component Type: Standard; Pin Count: 2; Value: 10uF; Status: Not Recommended; Case: B; Mounted: Yes; Socket: No; SMD: Yes; Sense: No; ComponentHeight: 5.8mm; HelpURL: \\cern.ch\dfs\Applications\Altium\Datasheets\CAE_PANASONIC_FK-V.pdf; Author: CERN DEM JLC; CreateDate: 03.12.2007; LatestRevisionDate: 05.11.2014
D25 = SM712: Asymmetrical TVS Diode for Extended Common-Mode RS-485; Manufacturer: SEMTECH; Voltage: 12V/-7V; Power: 400W; PressFit: No; Bonding: No; Part Number: SM712; Component Kind: Standard; Component Type: Standard; Device: SM712; PackageDescription: SOT, 0.95mm Pitch; 3 Pin, 1.30mm W X 2.92mm L X 1.12mm H body, IPC Medium Density; Status: Obsolete; Part Description: Asymmetrical TVS Diode for Extended Common-Mode RS-485; Manufacturer Part Number: SM712; Pin Count: 3; Case: SOT23-3; Mounted: Yes; Socket: No; SMD: Yes; Sense: No; ComponentHeight: 1.12mm; HelpURL: \\cern.ch\dfs\Applications\Altium\Datasheets\SM712.pdf; Author: CERN DEM JLC; CreateDate: 23.04.2012; LatestRevisionDate: 23.04.2012
IC4 = RFM-0505S: RECOM, RFM Serie, Single Output DCDC Converter; Part Description: 5V ±10% to 5V, Iout (max) 200mA, 1W DC-DC Converter; PressFit: No; Bonding: No; Part Number: RFM-0505S; Component Kind: Standard; Component Type: Standard; Device: RFM-0505S; PackageDescription: RFM Series, Body 11.5x6.00mm, SIP-4 Package; Manufacturer: RECOM; Manufacturer Part Number: RFM-0505S; Pin Count: 4; Mounted: Yes; Socket: No; SMD: No; Sense: No; ComponentHeight: 10.5mm; HelpURL: \\cern.ch\dfs\Applications\Altium\Datasheets\RFM-0505S.pdf; Author: CERN DEM BC; CreateDate: 16.07.2020; LatestRevisionDate: 16.07.2020
IC5-IC7 = FOD060L: Single Optocoupler; Part Description: LVTTL/LVCMOS 3.3V High Speed-10 MBit/s Logic Gate Optocoupler; Manufacturer: FAIRCHILD SEMICONDUCTOR; PressFit: No; Bonding: No; Part Number: FOD060L; Component Kind: Standard; Component Type: Standard; Device: FOD060L; PackageDescription: SOIC, 1.27mm Pitch; 8 Pin, 3.91mm W X 4.88mm L X 3.63mm H body, IPC Medium Density; Manufacturer Part Number: FOD060L; Pin Count: 8; Case: SOIC8; Mounted: Yes; Socket: No; SMD: Yes; Sense: No; ComponentHeight: 3.63mm; HelpURL: \\cern.ch\dfs\Applications\Altium\Datasheets\FOD060L.pdf; Author: CERN DEM JLC; CreateDate: 05.10.2011; LatestRevisionDate: 05.10.2011
IC8 = MAX3485CSA+: 3.3V-Powered, ±15kV ESD-Protected, 10Mbps,True RS-485/RS-422 Half Duplex Transceiver; Manufacturer: MAXIM; PressFit: No; Bonding: No; Part Number: MAX3485CSA+; Component Kind: Standard; Component Type: Standard; Device: MAX3485CSA+; PackageDescription: SOIC, 1.27mm Pitch; 8 Pin - Body 4x5mm, IPC Medium Density; Part Description: 3.3V-Powered, ±15kV ESD-Protected, 10Mbps,True RS-485/RS-422 Half Duplex Transceiver; Manufacturer Part Number: MAX3485CSA+; Pin Count: 8; Case: SOIC8; Mounted: Yes; Socket: No; SMD: Yes; Sense: No; ComponentHeight: 1.75mm; HelpURL: \\cern.ch\dfs\Applications\Altium\Datasheets\MAX3485CSA+.pdf; Author: CERN DEM JLC; CreateDate: 05.10.2009; LatestRevisionDate: 05.10.2009
L5 = IND_22UH_10%_MURATA-PS_8200: Inductor With Core; Part Description: Miniature Surface Mount Power Inductor (8200 Series); Manufacturer: MURATA POWER SOLUTIONS; Manufacturer Part Number: 82223C; Power: 320mA; Resistance: 0.92R; Tolerance: ±10%; Part Number: IND_22UH_10%_MURATA-PS_8200; Component Kind: Standard; Component Type: Standard; Pin Count: 2; Value: 22uH; Mounted: Yes; Socket: No; SMD: Yes; Sense: No; ComponentHeight: 2.3mm; HelpURL: \\cern.ch\dfs\Applications\Altium\Datasheets\IND_MURATA-PS_8200.pdf; Author: CERN DEM JMW; CreateDate: 07.10.2015; LatestRevisionDate: 07.10.2015
R116 R119 R121 = R0603_1K_1%_0.1W_100PPM: as R109 on sheet Sound; Part Number: R0603_1K_1%_0.1W_100PPM; Component Kind: Standard; Component Type: Standard; Pin Count: 2; Value: 1k; Status: Preferred; Manufacturer Part Number: R0603_1K_1%_0.1W_100PPM; Case: 0603; Mounted: Yes; Sense: No; Socket: No; SMD: Yes; Manufacturer1 Example: NIC COMPONENT; Manufacturer1 ComponentHeight: 0.55mm; HelpURL: \\cern.ch\dfs\Applications\Altium\Datasheets\R0603_NIC_NRC.pdf; Author: CERN DEM JLC; CreateDate: 03.12.2007; LatestRevisionDate: 13.03.2008
R117 R118 R120 = R0603_200R_1%_0.1W_100PPM: Resistor - 1%; Part Description: General Purpose Thick Film Chip Resistor; Manufacturer: GENERIC; Manufacturer1 Part Number: NRC06F2000TRF; Power: 0.1W; TC: ±100ppm/°C; PressFit: No; Part Number: R0603_200R_1%_0.1W_100PPM; Component Kind: Standard; Component Type: Standard; Pin Count: 2; Value: 200; Status: Preferred; Manufacturer Part Number: R0603_200R_1%_0.1W_100PPM; Case: 0603; Mounted: Yes; Sense: No; Socket: No; SMD: Yes; Manufacturer1 Example: NIC COMPONENT; Manufacturer1 ComponentHeight: 0.55mm; HelpURL: \\cern.ch\dfs\Applications\Altium\Datasheets\R0603_NIC_NRC.pdf; Author: CERN DEM JLC; CreateDate: 03.12.2007; LatestRevisionDate: 13.03.2008
R122 R123 = R0603_10K_1%_0.1W_100PPM: as R89 on sheet ShiftRegister; Part Number: R0603_10K_1%_0.1W_100PPM; Component Kind: Standard; Component Type: Standard; Pin Count: 2; Value: 10k; Status: Preferred; Manufacturer Part Number: R0603_10K_1%_0.1W_100PPM; Case: 0603; Mounted: Yes; Sense: No; Socket: No; SMD: Yes; Manufacturer1 Example: NIC COMPONENT; Manufacturer1 ComponentHeight: 0.55mm; HelpURL: \\cern.ch\dfs\Applications\Altium\Datasheets\R0603_NIC_NRC.pdf; Author: CERN DEM JLC; CreateDate: 03.12.2007; LatestRevisionDate: 13.03.2008
R124 = R1206_120R_1%_0.25W_100PPM: Resistor - 1%; Part Description: General Purpose Thick Film Chip Resistor; Manufacturer: GENERIC; Manufacturer1 Part Number: NRC12F1200TRF; Power: 0.25W; TC: ±100ppm/°C; PressFit: No; Part Number: R1206_120R_1%_0.25W_100PPM; Component Kind: Standard; Component Type: Standard; Pin Count: 2; Value: 120; Status: Preferred; Manufacturer Part Number: R1206_120R_1%_0.25W_100PPM; Case: 1206; Mounted: Yes; Sense: No; Socket: No; SMD: Yes; Manufacturer1 Example: NIC COMPONENT; Manufacturer1 ComponentHeight: 0.65mm; HelpURL: \\cern.ch\dfs\Applications\Altium\Datasheets\R1206_NIC_NRC.pdf; Author: CERN DEM JLC; CreateDate: 03.12.2007; LatestRevisionDate: 13.03.2008
R125 = R0603_0R_JUMPER: as R115 on sheet Sound; Part Number: R0603_0R_JUMPER; Component Kind: Standard; Component Type: Standard; Pin Count: 2; Value: 0; Status: Preferred; Manufacturer Part Number: R0603_0R_JUMPER; Case: 0603; Mounted: Yes; Sense: No; Socket: No; SMD: Yes; Manufacturer1 Example: NIC COMPONENT; Manufacturer1 ComponentHeight: 0.55mm; HelpURL: \\cern.ch\dfs\Applications\Altium\Datasheets\R0603_NIC_NRC.pdf; Author: CERN DEM JLC; CreateDate: 03.12.2007; LatestRevisionDate: 13.03.2008
SW1 = JUMPSMD0805_G50: 2 SMD Pads for Bound by Solder  Drop; Part Description: 2 SMD Pads for Bound by Solder Drop - Equivalent Size 0805 - Gap 0.5mm; Manufacturer: None; Mounted: No; PressFit: No; Part Number: JUMPSMD0805_G50; Component Type: Standard (No BOM); Pin Count: 2; PackageDescription: 2 SMD Pads for Bound by Solder Drop - Equivalent Size 0805 - Gap 0.5mm; Family: Switch; Socket: No; SMD: No; Sense: No; Status: None; Manufacturer Part Number: None; ComponentHeight: 0mm; HelpURL: None; Author: CERN DEM JLC; CreateDate: 26.08.2009; LatestRevisionDate: 12.02.2021
Tp41-Tp49 = Test point: Published: 8-Jun-2000; LatestRevisionDate: 17-Jul-2002; LatestRevisionNote: Re-released for DXP Platform.; PackageReference: AXIAL-0.3; Publisher: Altium Limited

## Sheet Optocoupler.SchDoc
size A4; SheetNumber: 9; SheetTotal: 11
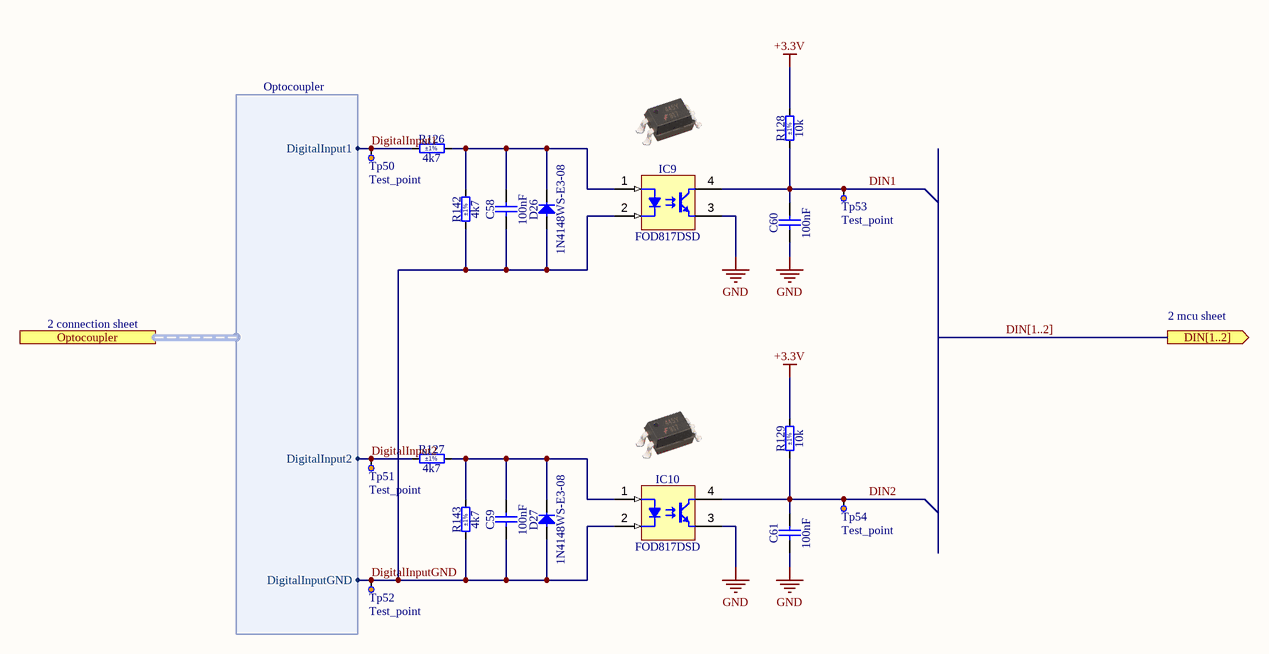
[diagram p7: Optocoupler.SchDoc]

### Parts
C58  100nF  [CAPC1608X87N]
C59  100nF  [CAPC1608X87N]
C60  100nF  [CAPC1608X87N]
C61  100nF  [CAPC1608X87N]
D26  1N4148WS-E3-08  [SOD2713X115N]
D27  1N4148WS-E3-08  [SOD2713X115N]
IC9  FOD817DSD  [FAIRCHILD_FOD817DSD]
IC10  FOD817DSD  [FAIRCHILD_FOD817DSD]
R126  4k7  Tolerance: ±1%  [RESC6331X70N]
R127  4k7  Tolerance: ±1%  [RESC6331X70N]
R128  10k  Tolerance: ±1%  [RESC1608X55N]
R129  10k  Tolerance: ±1%  [RESC1608X55N]
R142  4k7  Tolerance: ±1%  [RESC1608X55N]
R143  4k7  Tolerance: ±1%  [RESC1608X55N]
Tp50  Test_point  [TP_C40]
Tp51  Test_point  [TP_C40]
Tp52  Test_point  [TP_C40]
Tp53  Test_point  [TP_C40]
Tp54  Test_point  [TP_C40]

### Ports
DIN[1..2] (out), Optocoupler (harness Optocoupler)

### Harnesses
Optocoupler: DigitalInput1, DigitalInput2, DigitalInputGND

### Nets
+3.3V: R128.2 R129.2
GND: C60.1 C61.1 IC9.3(E) IC10.3(E)
DigitalInput1: R126.1 Tp50.1 ; port Optocoupler.DigitalInput1
DigitalInput2: R127.1 Tp51.1 ; port Optocoupler.DigitalInput2
DigitalInputGND: C58.1 C59.1 D26.2(A) D27.2(A) IC9.2(C) IC10.2(C) R142.1 R143.1 Tp52.1 ; port Optocoupler.DigitalInputGND
DIN1: C60.2 IC9.4(C) R128.1 Tp53.1
DIN2: C61.2 IC10.4(C) R129.1 Tp54.1
NetC58_2: C58.2 D26.1(C) IC9.1(A) R126.2 R142.2
NetC59_2: C59.2 D27.1(C) IC10.1(A) R127.2 R143.2

### Buses and harness runs
bus DIN[1..2] = port DIN[1..2]

### Notes on the sheet
- 2 connection sheet
- 2 mcu sheet
- THIS DOCUMENT AND THE DATA DISCLOSED HEREIN OR
- HEREWITH IS THE PROPERTY OF ALTIUM LIMITED AND MAY
- DWG NO:
- REVISION
- REV:
- DESCRIPTION
- DATE
- APPROVED
- BE FREELY DISTRIBUTED IN WHOLE. NO RIGHTS ARE
- RESERVED OR EXPRESS OR IMPLIED WARANTEE GIVEN.
- ENG:
- APPROVALS
- PROJECT
- DSN:
- CHK:
- REFERENCE DOCUMENTS
- PROJECT REVISION:
- TITLE
- DOCUMENT REVISION:
- DESIGN ITEM:
- BOM:
- FAB DWG:
- PCB DWG:
- ASSY DWG:
- SCALE:
- A3
- SIZE
- CAGE CODE
- FILE NAME
- DWG NO.
- SHEET
- OF
- REV

### Library data of the parts
C58-C61 = CC0603_100NF_50V_10%_X7R: as C42 on sheet ShiftRegister; Part Number: CC0603_100NF_50V_10%_X7R; Component Kind: Standard; Component Type: Standard; Pin Count: 2; Value: 100nF; Status: Preferred; Manufacturer Part Number: CC0603_100NF_50V_10%_X7R; Case: 0603; Mounted: Yes; Socket: No; SMD: Yes; Sense: No; Manufacturer1 Example: PHYCOMP; Manufacturer1 ComponentHeight: 0.87mm; HelpURL: \\cern.ch\dfs\Applications\Altium\Datasheets\CC0603_X7R_PHYCOMP.pdf; Author: CERN DEM JLC; CreateDate: 03.12.2007; LatestRevisionDate: 03.12.2007
D26 D27 = 1N4148WS-E3-08: Diode; Part Description: Small Signal Fast Switching Diode; Manufacturer: VISHAY SEMICONDUCTORS; Voltage: 75V; Power: 150mA; PressFit: No; Bonding: No; Part Number: 1N4148WS-E3-08; Component Kind: Standard; Component Type: Standard; Device: 1N4148WS-E3-08; PackageDescription: SOD-323 Diode; 1.775mm W X 1.30mm L X 1.15mm H Body, IPC Medium Density; Manufacturer Part Number: 1N4148WS-E3-08; Pin Count: 3; Case: SOD-323; Mounted: Yes; Socket: No; SMD: Yes; Sense: No; ComponentHeight: 1.15mm; HelpURL: \\cern.ch\dfs\Applications\Altium\Datasheets\1N4148WS-E3-08.pdf; Author: CERN DEM JLC; CreateDate: 16.12.2013; LatestRevisionDate: 16.12.2013
IC9 IC10 = FOD817DSD: Single Optocoupler; Part Description: 4-Pin High Operating Temperature Phototransistor Optocoupler; Manufacturer: FAIRCHILD SEMICONDUCTOR; PressFit: No; Bonding: No; Part Number: FOD817DSD; Component Kind: Standard; Component Type: Standard; Device: FOD817DSD; PackageDescription: SOIC, 2.54mm Pitch; 4 Pin, 6.50mm W X 4.60mm L X 4.60mm H body; Manufacturer Part Number: FOD817DSD; Pin Count: 4; Case: SOIC4; Mounted: Yes; Socket: No; SMD: Yes; Sense: No; ComponentHeight: 4.6mm; HelpURL: \\cern.ch\dfs\Applications\Altium\Datasheets\FOD817DSD.pdf; Author: CERN DEM JLC; CreateDate: 21.07.2014; LatestRevisionDate: 21.07.2014
R126 R127 = R2512_4K7_1%_1W_100PPM: Resistor - 1%; Part Description: Thick Film Chip Resistor; Manufacturer: GENERIC; Manufacturer1 Part Number: 232276364702L or RC2512FK-074K7L; Power: 1W; TC: ±100ppm/°C; PressFit: No; Part Number: R2512_4K7_1%_1W_100PPM; Component Kind: Standard; Component Type: Standard; Pin Count: 2; Value: 4k7; Status: Preferred; Manufacturer Part Number: R2512_4K7_1%_1W_100PPM; Case: 2512; Mounted: Yes; Sense: No; Socket: No; SMD: Yes; Manufacturer1 Example: YAGEO PHYCOMP; Manufacturer1 ComponentHeight: 0.65mm; HelpURL: \\cern.ch\dfs\Applications\Altium\Datasheets\R2512_Phycomp_RC2512.pdf; Author: CERN DEM JLC; CreateDate: 21.07.2008; LatestRevisionDate: 17.10.2012
R128 R129 = R0603_10K_1%_0.1W_100PPM: as R89 on sheet ShiftRegister; Part Number: R0603_10K_1%_0.1W_100PPM; Component Kind: Standard; Component Type: Standard; Pin Count: 2; Value: 10k; Status: Preferred; Manufacturer Part Number: R0603_10K_1%_0.1W_100PPM; Case: 0603; Mounted: Yes; Sense: No; Socket: No; SMD: Yes; Manufacturer1 Example: NIC COMPONENT; Manufacturer1 ComponentHeight: 0.55mm; HelpURL: \\cern.ch\dfs\Applications\Altium\Datasheets\R0603_NIC_NRC.pdf; Author: CERN DEM JLC; CreateDate: 03.12.2007; LatestRevisionDate: 13.03.2008
R142 R143 = R0603_4K7_1%_0.1W_100PPM: as R111 on sheet Sound; Part Number: R0603_4K7_1%_0.1W_100PPM; Component Kind: Standard; Component Type: Standard; Pin Count: 2; Value: 4k7; Status: Preferred; Manufacturer Part Number: R0603_4K7_1%_0.1W_100PPM; Case: 0603; Mounted: Yes; Sense: No; Socket: No; SMD: Yes; Manufacturer1 Example: NIC COMPONENT; Manufacturer1 ComponentHeight: 0.55mm; HelpURL: \\cern.ch\dfs\Applications\Altium\Datasheets\R0603_NIC_NRC.pdf; Author: CERN DEM JLC; CreateDate: 03.12.2007; LatestRevisionDate: 13.03.2008
Tp50-Tp54 = Test point: Published: 8-Jun-2000; LatestRevisionDate: 17-Jul-2002; LatestRevisionNote: Re-released for DXP Platform.; PackageReference: AXIAL-0.3; Publisher: Altium Limited

## Sheet Button.SchDoc
size A4; SheetNumber: 10; SheetTotal: 11
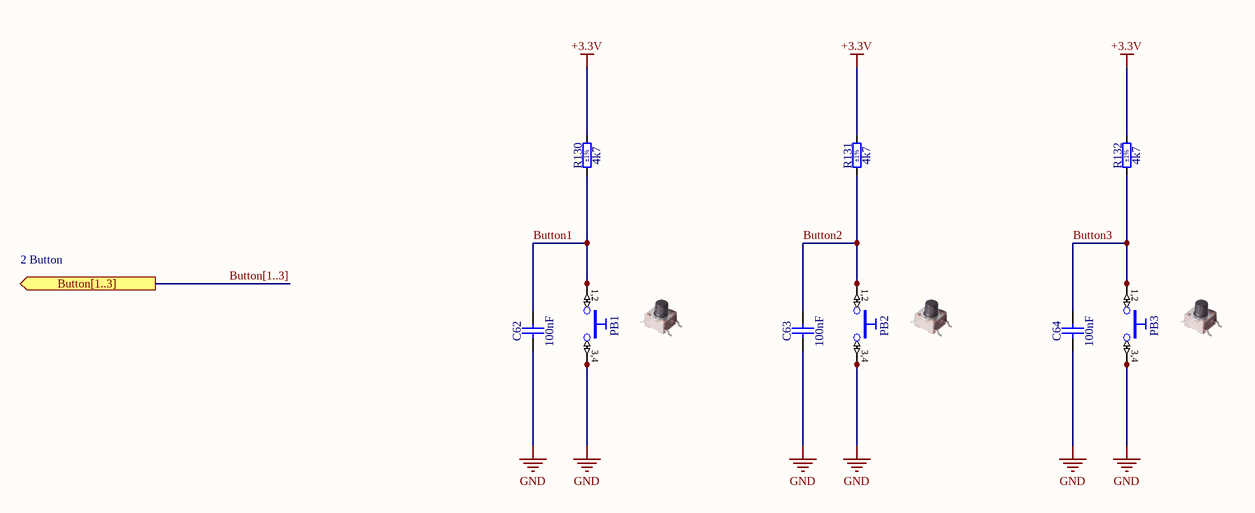
[diagram p8: Button.SchDoc]

### Parts
C62  100nF  [CAPC1608X87N]
C63  100nF  [CAPC1608X87N]
C64  100nF  [CAPC1608X87N]
PB1  Push Button  [PB_TYCO_FSM6JSMA]  (value not drawn)
PB2  Push Button  [PB_TYCO_FSM6JSMA]  (value not drawn)
PB3  Push Button  [PB_TYCO_FSM6JSMA]  (value not drawn)
R130  4k7  Tolerance: ±1%  [RESC1608X55N]
R131  4k7  Tolerance: ±1%  [RESC1608X55N]
R132  4k7  Tolerance: ±1%  [RESC1608X55N]

### Ports
Button[1..3] (out)

### Nets
+3.3V: R130.2 R131.2 R132.2
GND: C62.1 C63.1 C64.1 PB1.3 PB1.4 PB2.3 PB2.4 PB3.3 PB3.4
Button1: C62.2 PB1.1 PB1.2 R130.1
Button2: C63.2 PB2.1 PB2.2 R131.1
Button3: C64.2 PB3.1 PB3.2 R132.1

### Buses and harness runs
bus Button[1..3] = port Button[1..3]

### Notes on the sheet
- 2 Button
- THIS DOCUMENT AND THE DATA DISCLOSED HEREIN OR
- HEREWITH IS THE PROPERTY OF ALTIUM LIMITED AND MAY
- DWG NO:
- REVISION
- REV:
- DESCRIPTION
- DATE
- APPROVED
- BE FREELY DISTRIBUTED IN WHOLE. NO RIGHTS ARE
- RESERVED OR EXPRESS OR IMPLIED WARANTEE GIVEN.
- ENG:
- APPROVALS
- PROJECT
- DSN:
- CHK:
- REFERENCE DOCUMENTS
- PROJECT REVISION:
- TITLE
- DOCUMENT REVISION:
- DESIGN ITEM:
- BOM:
- FAB DWG:
- PCB DWG:
- ASSY DWG:
- SCALE:
- A3
- SIZE
- CAGE CODE
- FILE NAME
- DWG NO.
- SHEET
- OF
- REV
- (in symbol PB_TYCO_FSM6JSMA) 1,2; 3,4

### Library data of the parts
C62-C64 = CC0603_100NF_50V_10%_X7R: as C42 on sheet ShiftRegister; Part Number: CC0603_100NF_50V_10%_X7R; Component Kind: Standard; Component Type: Standard; Pin Count: 2; Value: 100nF; Status: Preferred; Manufacturer Part Number: CC0603_100NF_50V_10%_X7R; Case: 0603; Mounted: Yes; Socket: No; SMD: Yes; Sense: No; Manufacturer1 Example: PHYCOMP; Manufacturer1 ComponentHeight: 0.87mm; HelpURL: \\cern.ch\dfs\Applications\Altium\Datasheets\CC0603_X7R_PHYCOMP.pdf; Author: CERN DEM JLC; CreateDate: 03.12.2007; LatestRevisionDate: 03.12.2007
PB1-PB3 = PB_TYCO_FSM6JSMA: Push-Button Switch SPDT; Part Description: 12VDC 50mA SPST Tactile  Push-Button Switch; Manufacturer: TYCO ELECTRONICS; Manufacturer Part Number: FSM6JSMA or  4-1437565-9; PressFit: No; Part Number: PB_TYCO_FSM6JSMA; Component Kind: Standard; Component Type: Standard; Pin Count: 4; PackageDescription: Body 6mm x 6mm, Surface Mount Tactile Switches, TYCO ALCOSWITCH FSMJSMA Series; Family: Push Button; Mounted: Yes; Socket: No; SMD: Yes; Sense: No; Status: None; ComponentHeight: 7.11mm; HelpURL: \\cern.ch\dfs\Applications\Altium\Datasheets\PB_TYCO_FSM6JSMA.pdf; Author: CERN DEM JLC; CreateDate: 21.06.2012; LatestRevisionDate: 21.06.2012
R130-R132 = R0603_4K7_1%_0.1W_100PPM: as R111 on sheet Sound; Part Number: R0603_4K7_1%_0.1W_100PPM; Component Kind: Standard; Component Type: Standard; Pin Count: 2; Value: 4k7; Status: Preferred; Manufacturer Part Number: R0603_4K7_1%_0.1W_100PPM; Case: 0603; Mounted: Yes; Sense: No; Socket: No; SMD: Yes; Manufacturer1 Example: NIC COMPONENT; Manufacturer1 ComponentHeight: 0.55mm; HelpURL: \\cern.ch\dfs\Applications\Altium\Datasheets\R0603_NIC_NRC.pdf; Author: CERN DEM JLC; CreateDate: 03.12.2007; LatestRevisionDate: 13.03.2008

## Sheet Relay.SchDoc
size A4; SheetNumber: 11; SheetTotal: 11
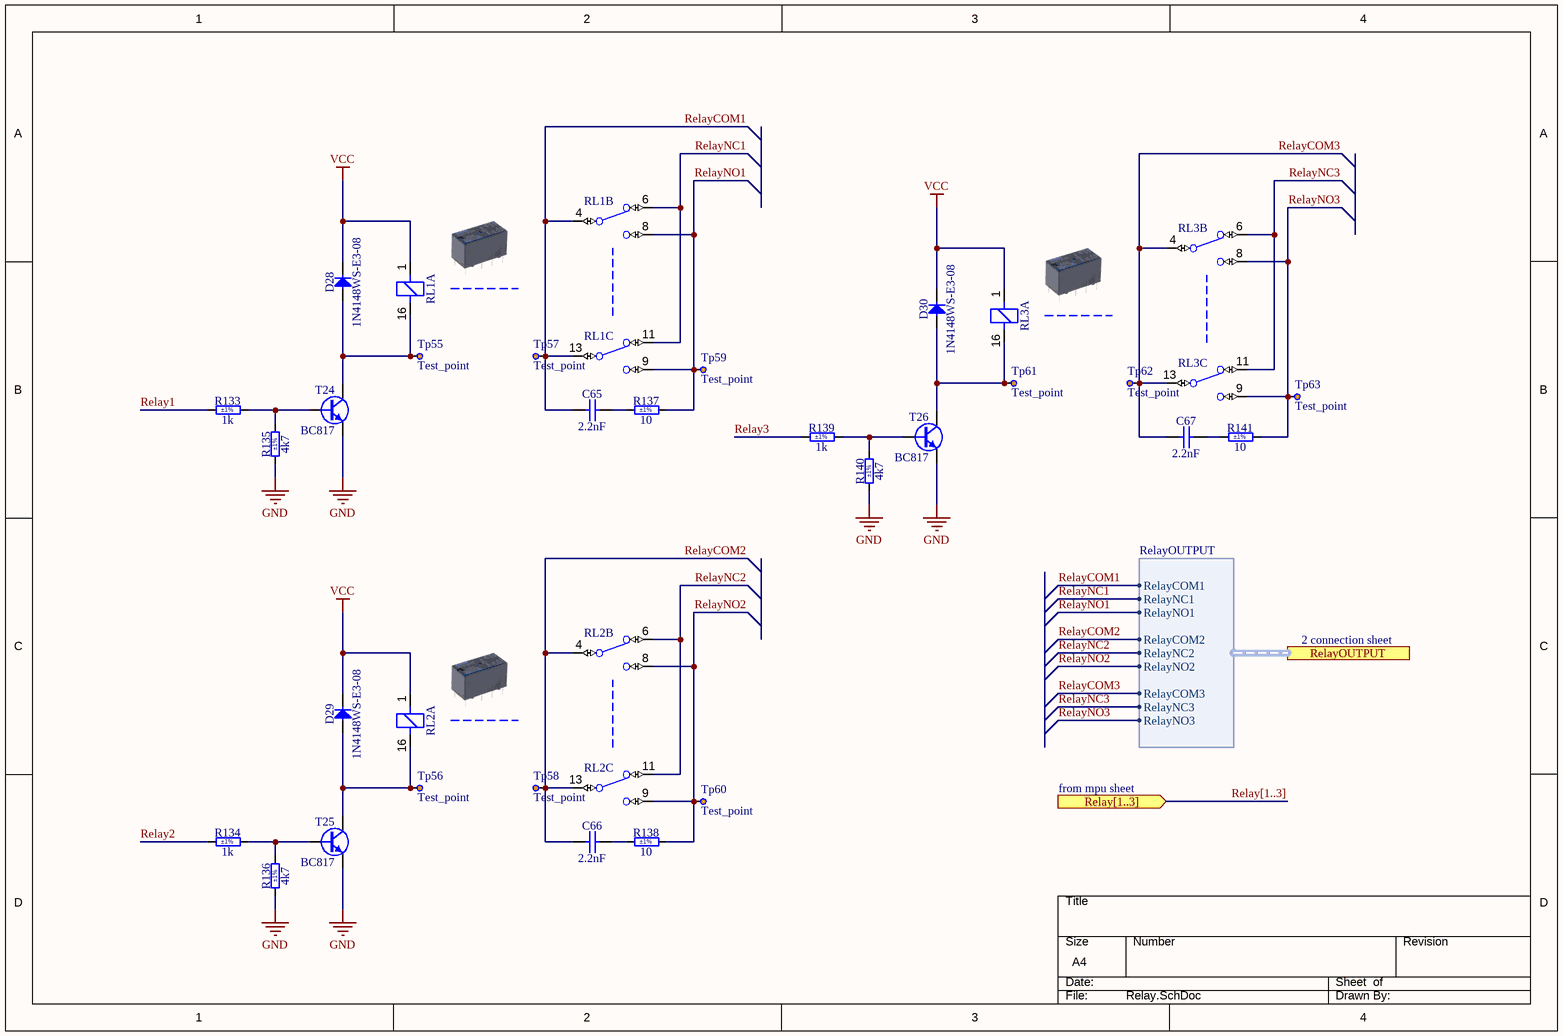
[diagram p9: Relay.SchDoc]

### Parts
C65  2.2nF  [CAPRB_MURATA_DE2E3KY222MA2BM01F]
C66  2.2nF  [CAPRB_MURATA_DE2E3KY222MA2BM01F]
C67  2.2nF  [CAPRB_MURATA_DE2E3KY222MA2BM01F]
D28  1N4148WS-E3-08  [SOD2713X115N]
D29  1N4148WS-E3-08  [SOD2713X115N]
D30  1N4148WS-E3-08  [SOD2713X115N]
R133  1k  Tolerance: ±1%  [RESC1608X55N]
R134  1k  Tolerance: ±1%  [RESC1608X55N]
R135  4k7  Tolerance: ±1%  [RESC1608X55N]
R136  4k7  Tolerance: ±1%  [RESC1608X55N]
R137  10  Tolerance: ±1%  [RESC3216X65N]
R138  10  Tolerance: ±1%  [RESC3216X65N]
R139  1k  Tolerance: ±1%  [RESC1608X55N]
R140  4k7  Tolerance: ±1%  [RESC1608X55N]
R141  10  Tolerance: ±1%  [RESC3216X65N]
RL1  REL_OMRON_G5V-2  [REL_OMRON_G5V-2]  (value not drawn)  (parts A,B,C of 3)
RL2  REL_OMRON_G5V-2  [REL_OMRON_G5V-2]  (value not drawn)  (parts A,B,C of 3)
RL3  REL_OMRON_G5V-2  [REL_OMRON_G5V-2]  (value not drawn)  (parts A,B,C of 3)
T24  BC817  [SOT95P230X110-3N]
T25  BC817  [SOT95P230X110-3N]
T26  BC817  [SOT95P230X110-3N]
Tp55  Test_point  [TP_C40]
Tp56  Test_point  [TP_C40]
Tp57  Test_point  [TP_C40]
Tp58  Test_point  [TP_C40]
Tp59  Test_point  [TP_C40]
Tp60  Test_point  [TP_C40]
Tp61  Test_point  [TP_C40]
Tp62  Test_point  [TP_C40]
Tp63  Test_point  [TP_C40]

### Ports
Relay[1..3] (in), RelayOUTPUT (harness RelayOUTPUT)

### Harnesses
RelayOUTPUT: RelayCOM1, RelayNC1, RelayNO1, RelayCOM2, RelayNC2, RelayNO2, RelayCOM3, RelayNC3, RelayNO3

### Nets
GND: R135.1 R136.1 R140.1 T24.2(E) T25.2(E) T26.2(E)
VCC: D28.1(C) D29.1(C) D30.1(C) RL1.1 RL2.1 RL3.1
Relay1: R133.1
Relay2: R134.1
Relay3: R139.1
RelayCOM1: C65.1 RL1.4(C) RL1.13(C) Tp57.1 ; port RelayOUTPUT.RelayCOM1
RelayCOM2: C66.1 RL2.4(C) RL2.13(C) Tp58.1 ; port RelayOUTPUT.RelayCOM2
RelayCOM3: C67.1 RL3.4(C) RL3.13(C) Tp62.1 ; port RelayOUTPUT.RelayCOM3
RelayNC1: RL1.6(NC) RL1.11(NC) ; port RelayOUTPUT.RelayNC1
RelayNC2: RL2.6(NC) RL2.11(NC) ; port RelayOUTPUT.RelayNC2
RelayNC3: RL3.6(NC) RL3.11(NC) ; port RelayOUTPUT.RelayNC3
RelayNO1: R137.2 RL1.8(NO) RL1.9(NO) Tp59.1 ; port RelayOUTPUT.RelayNO1
RelayNO2: R138.2 RL2.8(NO) RL2.9(NO) Tp60.1 ; port RelayOUTPUT.RelayNO2
RelayNO3: R141.2 RL3.8(NO) RL3.9(NO) Tp63.1 ; port RelayOUTPUT.RelayNO3
NetC65_2: C65.2 R137.1
NetC66_2: C66.2 R138.1
NetC67_2: C67.2 R141.1
NetD28_2: D28.2(A) RL1.16 T24.3(C) Tp55.1
NetD29_2: D29.2(A) RL2.16 T25.3(C) Tp56.1
NetD30_2: D30.2(A) RL3.16 T26.3(C) Tp61.1
NetR133_2: R133.2 R135.2 T24.1(B)
NetR134_2: R134.2 R136.2 T25.1(B)
NetR139_2: R139.2 R140.2 T26.1(B)

### Buses and harness runs
bus Relay[1..3] = port Relay[1..3]

### Notes on the sheet
- 2 connection sheet
- from mpu sheet

### Library data of the parts
C65-C67 = CCR_2.2NF_250V_20%_MURATA_DE2E3KY222MA2BM01F: Non-polarised capacitor; Part Description: Disc Ceramic Capacitors for General Purpose, Type KY (Basic Insulation) - Class X1 Y2; Manufacturer: MURATA; Voltage: 250VAC; Tolerance: ±20%; Part Number: CCR_2.2NF_250V_20%_MURATA_DE2E3KY222MA2BM01F; Component Kind: Standard; Component Type: Standard; Pin Count: 2; Value: 2.2nF; Status: None; Manufacturer Part Number: DE2E3KY222MA2BM01F; Case: LS5 W5 x D8; Mounted: Yes; Socket: No; SMD: No; Sense: No; ComponentHeight: 11mm; HelpURL: \\cern.ch\dfs\Applications\Altium\Datasheets\CCR_MURATA_DE2E3KY222MA2BM01F.pdf; Author: CERN DEM JLC; CreateDate: 17.09.2018; LatestRevisionDate: 17.09.2018
D28-D30 = 1N4148WS-E3-08: as D26 on sheet Optocoupler; Part Number: 1N4148WS-E3-08; Component Kind: Standard; Component Type: Standard; Device: 1N4148WS-E3-08; PackageDescription: SOD-323 Diode; 1.775mm W X 1.30mm L X 1.15mm H Body, IPC Medium Density; Manufacturer Part Number: 1N4148WS-E3-08; Pin Count: 3; Case: SOD-323; Mounted: Yes; Socket: No; SMD: Yes; Sense: No; ComponentHeight: 1.15mm; HelpURL: \\cern.ch\dfs\Applications\Altium\Datasheets\1N4148WS-E3-08.pdf; Author: CERN DEM JLC; CreateDate: 16.12.2013; LatestRevisionDate: 16.12.2013
R133 R134 R139 = R0603_1K_1%_0.1W_100PPM: as R109 on sheet Sound; Part Number: R0603_1K_1%_0.1W_100PPM; Component Kind: Standard; Component Type: Standard; Pin Count: 2; Value: 1k; Status: Preferred; Manufacturer Part Number: R0603_1K_1%_0.1W_100PPM; Case: 0603; Mounted: Yes; Sense: No; Socket: No; SMD: Yes; Manufacturer1 Example: NIC COMPONENT; Manufacturer1 ComponentHeight: 0.55mm; HelpURL: \\cern.ch\dfs\Applications\Altium\Datasheets\R0603_NIC_NRC.pdf; Author: CERN DEM JLC; CreateDate: 03.12.2007; LatestRevisionDate: 13.03.2008
R135 R136 R140 = R0603_4K7_1%_0.1W_100PPM: as R111 on sheet Sound; Part Number: R0603_4K7_1%_0.1W_100PPM; Component Kind: Standard; Component Type: Standard; Pin Count: 2; Value: 4k7; Status: Preferred; Manufacturer Part Number: R0603_4K7_1%_0.1W_100PPM; Case: 0603; Mounted: Yes; Sense: No; Socket: No; SMD: Yes; Manufacturer1 Example: NIC COMPONENT; Manufacturer1 ComponentHeight: 0.55mm; HelpURL: \\cern.ch\dfs\Applications\Altium\Datasheets\R0603_NIC_NRC.pdf; Author: CERN DEM JLC; CreateDate: 03.12.2007; LatestRevisionDate: 13.03.2008
R137 R138 R141 = R1206_10R_1%_0.25W_100PPM: Resistor - 1%; Part Description: General Purpose Thick Film Chip Resistor; Manufacturer: GENERIC; Manufacturer1 Part Number: NRC12F10R0TRF; Power: 0.25W; TC: ±100ppm/°C; PressFit: No; Part Number: R1206_10R_1%_0.25W_100PPM; Component Kind: Standard; Component Type: Standard; Pin Count: 2; Value: 10; Status: Preferred; Manufacturer Part Number: R1206_10R_1%_0.25W_100PPM; Case: 1206; Mounted: Yes; Sense: No; Socket: No; SMD: Yes; Manufacturer1 Example: NIC COMPONENT; Manufacturer1 ComponentHeight: 0.65mm; HelpURL: \\cern.ch\dfs\Applications\Altium\Datasheets\R1206_NIC_NRC.pdf; Author: CERN DEM BC; CreateDate: 14.12.2020; LatestRevisionDate: 14.12.2020
RL1-RL3 = REL_OMRON_G5V-2-H1 24VDC: Miniature Relay for Signal Circuits; Part Description: DPDT High Sensitivity Miniature Relay for Signal Circuits, G5V-2 Series; Manufacturer: OMRON ELECTRONIC; Manufacturer Part Number: G5V-2-H1 24DC; PressFit: No; Value: 24VDC; Part Number: REL_OMRON_G5V-2-H1 24VDC; Component Kind: Standard; Component Type: Standard; Pin Count: 8; PackageDescription: 8 Leads, Row Spacing 7.62mm; Body 20.5mm x 10.1mm, OMRON_G5V-2 Series; Mounted: Yes; Socket: No; SMD: No; Sense: No; Status: None; ComponentHeight: 11.5mm; HelpURL: \\cern.ch\dfs\Applications\Altium\Datasheets\REL_OMRON_G5V-2.pdf; Author: CERN DEM JLC; CreateDate: 23.09.2010; LatestRevisionDate: 23.09.2010
T24-T26 = BC817: as T19 on sheet Sound; Part Number: BC817; Component Kind: Standard; Component Type: Standard; Device: BC817; PackageDescription: SOT23, 0.95mm Pitch; 3 Pin, 1.30mm W X 2.90mm L X 1.10mm H body, IPC Medium Density; Manufacturer Part Number: BC817; Pin Count: 3; Case: SOT23-3; Mounted: Yes; Socket: No; SMD: Yes; Sense: No; ComponentHeight: 1.1mm; HelpURL: \\cern.ch\dfs\Applications\Altium\Datasheets\BC817.pdf; Author: CERN DEM JLC; CreateDate: 12.05.2011; LatestRevisionDate: 12.05.2011
Tp55-Tp63 = Test point: Published: 8-Jun-2000; LatestRevisionDate: 17-Jul-2002; LatestRevisionNote: Re-released for DXP Platform.; PackageReference: AXIAL-0.3; Publisher: Altium Limited

## Nets that join several sheets
+3.3V: Power (6 pins), Sensing (8 pins), FlashMemory (16 pins), mcu (L3.1 P1.1 R82.1 R83.1), ShiftRegister (R89.2 R90.2 R91.2 R92.2), Interface (6 pins), Optocoupler (R128.2 R129.2), Button (R130.2 R131.2 R132.2)
+5V: Power (10 pins), ShiftRegister (8 pins), Sound (D21.1 SP1.1), Interface (C50.2 L5.1)
GND: Power (31 pins), Sensing (64 pins), FlashMemory (9 pins), mcu (13 pins), ShiftRegister (24 pins), Sound (11 pins), Interface (5 pins), Optocoupler (C60.1 C61.1 IC9.3 IC10.3), Button (9 pins), Relay (6 pins)
VCC: Power (12 pins), mcu (R85.2), Sound (L4.1), Relay (6 pins)
AudioPWM: mcu (U1.30), Sound (R109.1)
Button1: mcu (U1.32), Button (C62.2 PB1.1 PB1.2 R130.1)
Button2: mcu (U1.33), Button (C63.2 PB2.1 PB2.2 R131.1)
Button3: mcu (U1.31), Button (C64.2 PB3.1 PB3.2 R132.1)
BuzzerPWM: mcu (U1.39), Sound (R110.1)
DIN1: mcu (U1.2), Optocoupler (C60.2 IC9.4 R128.1 Tp53.1)
DIN2: mcu (U1.3), Optocoupler (C61.2 IC10.4 R129.1 Tp54.1)
InterfaceDE: mcu (U1.34), Interface (IC6.3 Tp42.1)
InterfaceDI: mcu (U1.45), Interface (IC7.3 Tp43.1)
InterfaceRO: mcu (U1.46), Interface (IC5.6 R116.1 Tp41.1)
Relay1: mcu (U1.47), Relay (R133.1)
Relay2: mcu (U1.48), Relay (R134.1)
Relay3: mcu (U1.1), Relay (R139.1)
SDCardCLK: FlashMemory (D20.4 J1.5 R78.1), mcu (U1.42)
SDCardCS: FlashMemory (D20.1 J1.2 R80.1), mcu (U1.37)
SDCardDET: FlashMemory (C31.2 J1.G4 R75.1), mcu (U1.38)
SDCardDI: FlashMemory (D20.6 J1.3 R79.1), mcu (U1.44)
SDCardDO: FlashMemory (D20.3 J1.7 R77.1), mcu (U1.43)
SensorEnable1: Sensing (R1.1), ShiftRegister (U2.15)
SensorEnable2: Sensing (R2.1), ShiftRegister (U2.2)
SensorEnable3: Sensing (R3.1), ShiftRegister (U2.4)
SensorEnable4: Sensing (R4.1), ShiftRegister (U2.6)
SensorEnable5: Sensing (R17.1), ShiftRegister (U3.15)
SensorEnable6: Sensing (R18.1), ShiftRegister (U3.2)
SensorEnable7: Sensing (R19.1), ShiftRegister (U3.4)
SensorEnable8: Sensing (R20.1), ShiftRegister (U3.6)
SensorEnable9: Sensing (R33.1), ShiftRegister (U4.15)
SensorEnable10: Sensing (R34.1), ShiftRegister (U4.2)
SensorEnable11: Sensing (R35.1), ShiftRegister (U4.4)
SensorEnable12: Sensing (R36.1), ShiftRegister (U4.6)
SensorEnable13: Sensing (R49.1), ShiftRegister (U5.15)
SensorEnable14: Sensing (R50.1), ShiftRegister (U5.2)
SensorEnable15: Sensing (R51.1), ShiftRegister (U5.4)
SensorEnable16: Sensing (R52.1), ShiftRegister (U5.6)
SensorPowerEnable: Power (R67.1), mcu (U1.41)
SensorSignal1: Sensing (C1.2 D1.3 D2.3 Tp5.1), mcu (U1.11)
SensorSignal2: Sensing (C2.2 D3.3 D4.3 Tp6.1), mcu (U1.12)
SensorSignal3: Sensing (C3.2 D5.3 D8.3 Tp7.1), mcu (U1.13)
SensorSignal4: Sensing (C4.2 D6.3 D9.3 Tp8.1), mcu (U1.14)
SensorSignal5: Sensing (C5.2 D7.3 D13.3 Tp13.1), mcu (U1.15)
SensorSignal6: Sensing (C6.2 D10.3 D14.3 Tp14.1), mcu (U1.16)
SensorSignal7: Sensing (C7.2 D11.3 D15.3 Tp15.1), mcu (U1.17)
SensorSignal8: Sensing (C8.2 D12.3 D16.3 Tp20.1), mcu (U1.18)
ShOE: mcu (U1.26), ShiftRegister (5 pins)
ShRCLK: mcu (U1.27), ShiftRegister (5 pins)
ShSER: mcu (U1.25), ShiftRegister (U2.14)
ShSRCLK: mcu (U1.28), ShiftRegister (5 pins)
ShSRCLR: mcu (U1.29), ShiftRegister (5 pins)
SPIFlashCLK: FlashMemory (IC3.6 R74.1), mcu (U1.22)
SPIFlashCS: FlashMemory (IC3.1 R73.1), mcu (U1.24)
SPIFlashDI: FlashMemory (IC3.5), mcu (U1.23)
SPIFlashDO: FlashMemory (IC3.2), mcu (U1.21)